# EAGLE design electrosteel2020_10_arrange6_synthboardsonly2 (EAGLE 9.6.2)
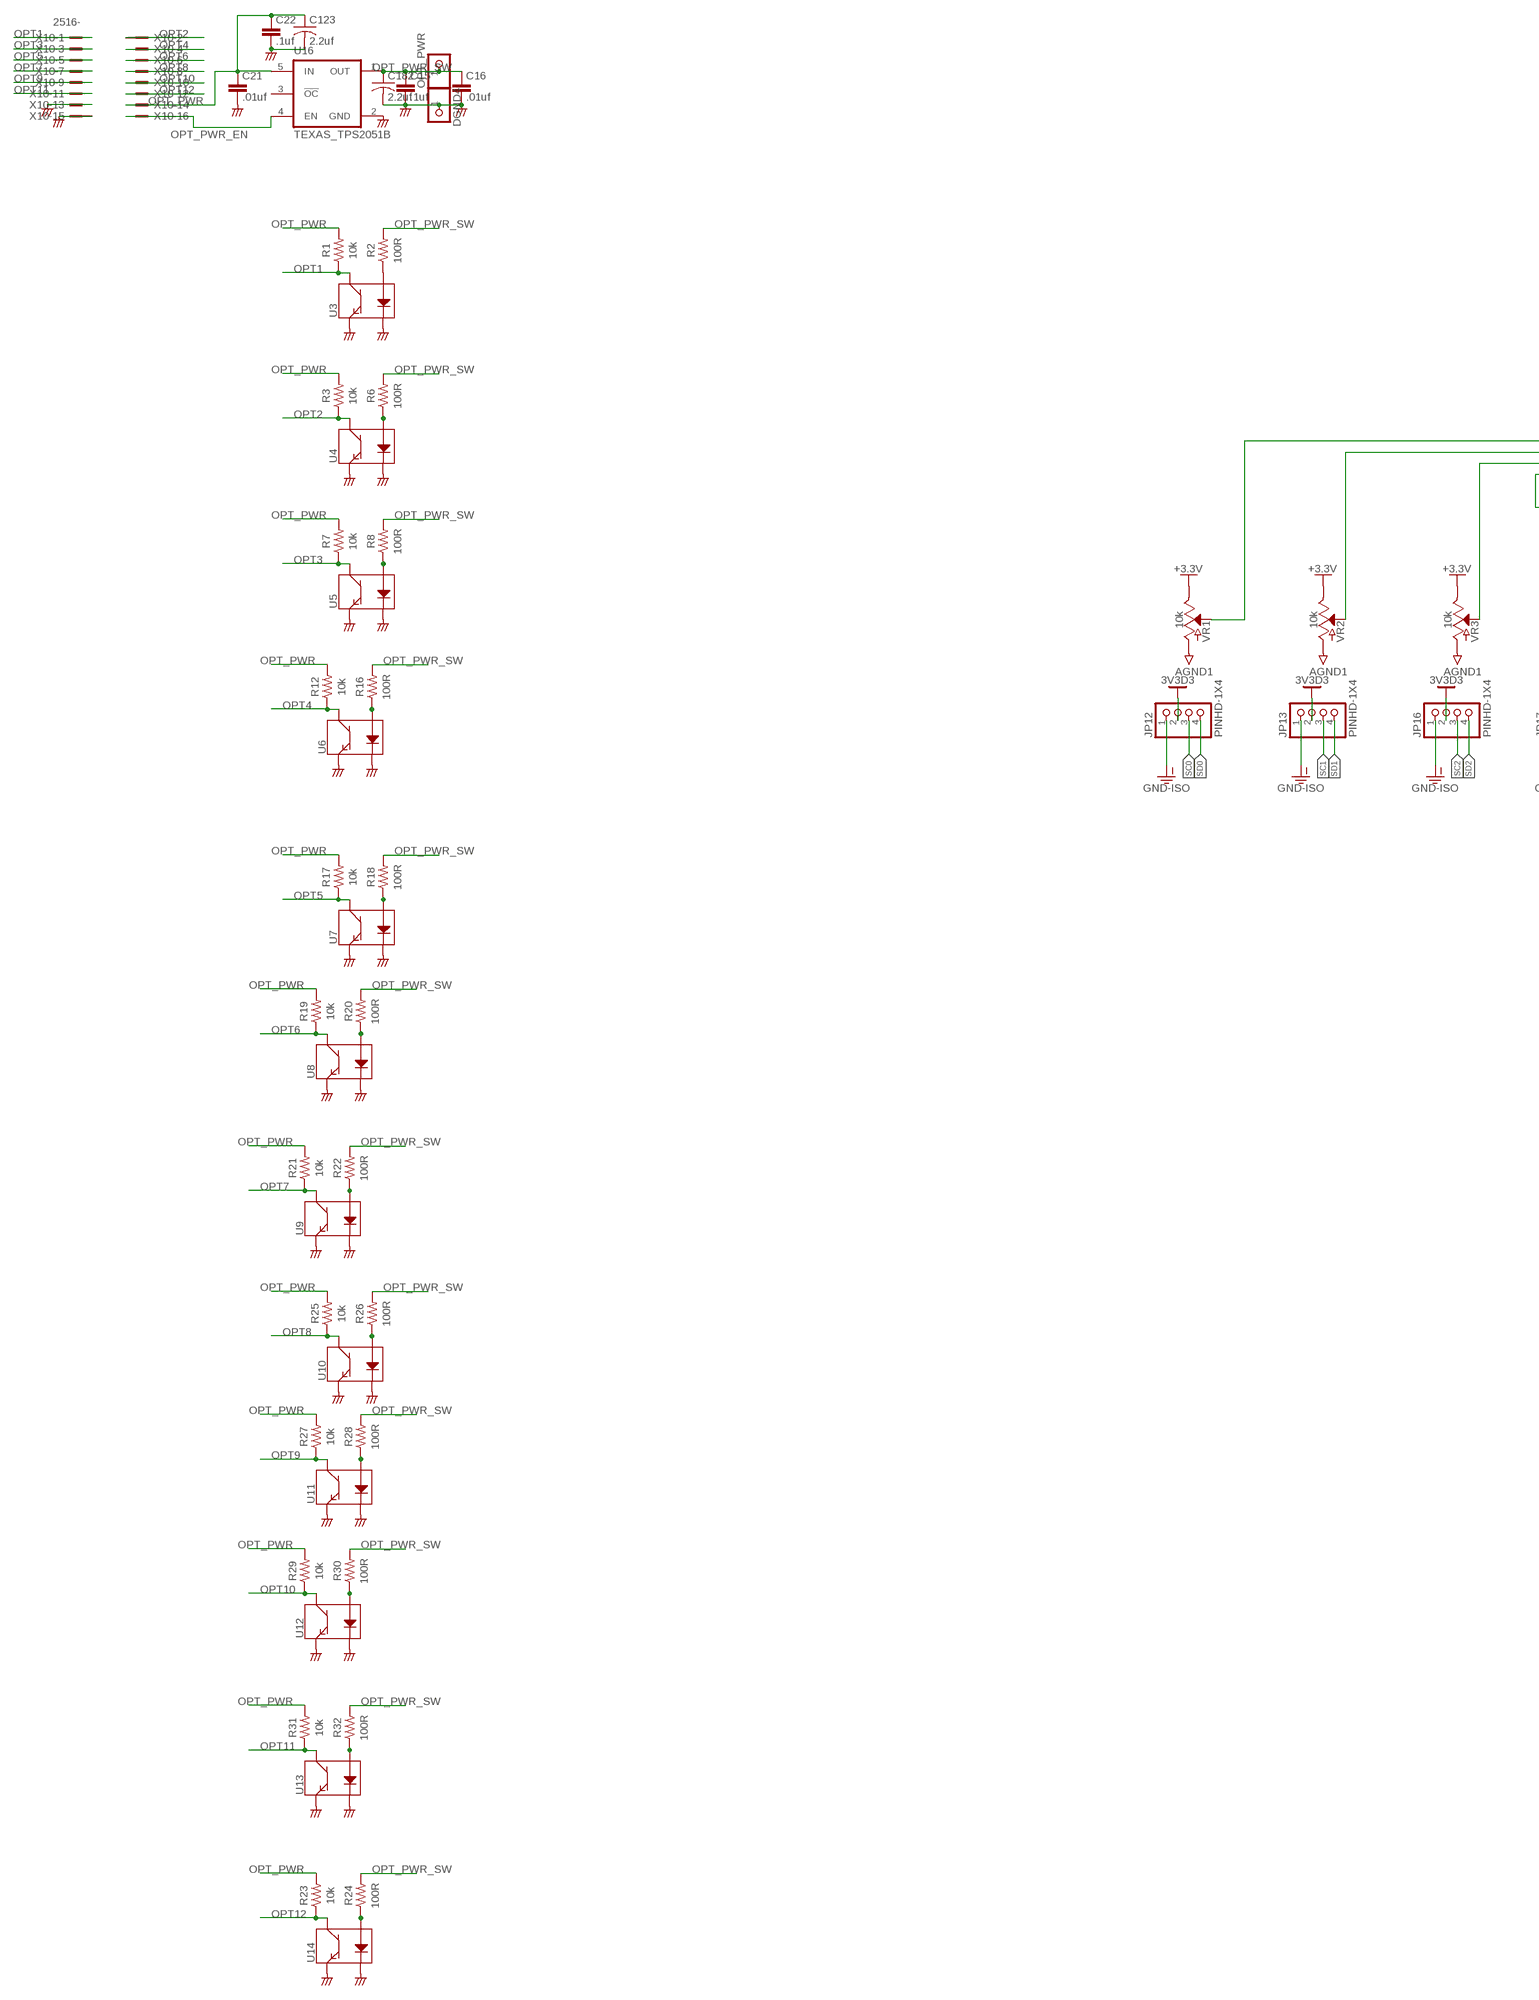
[diagram p0: schematic, sheet 1, part 1 of 3]
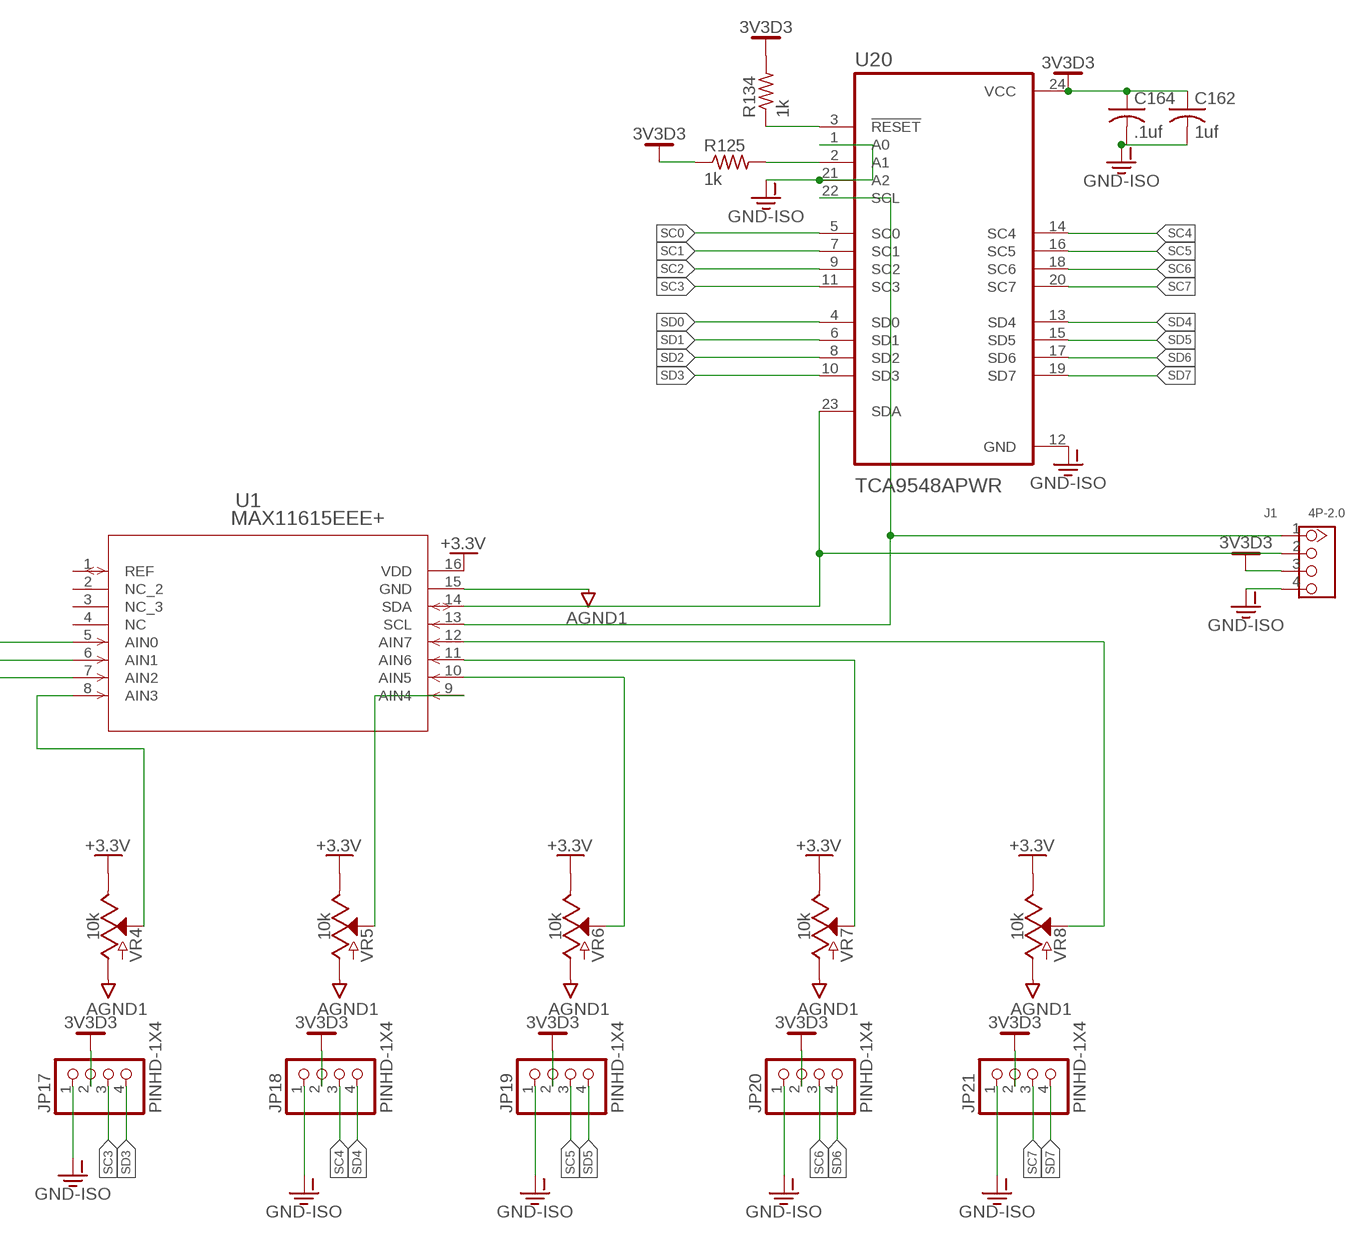
[diagram p1: schematic, sheet 1, part 2 of 3]
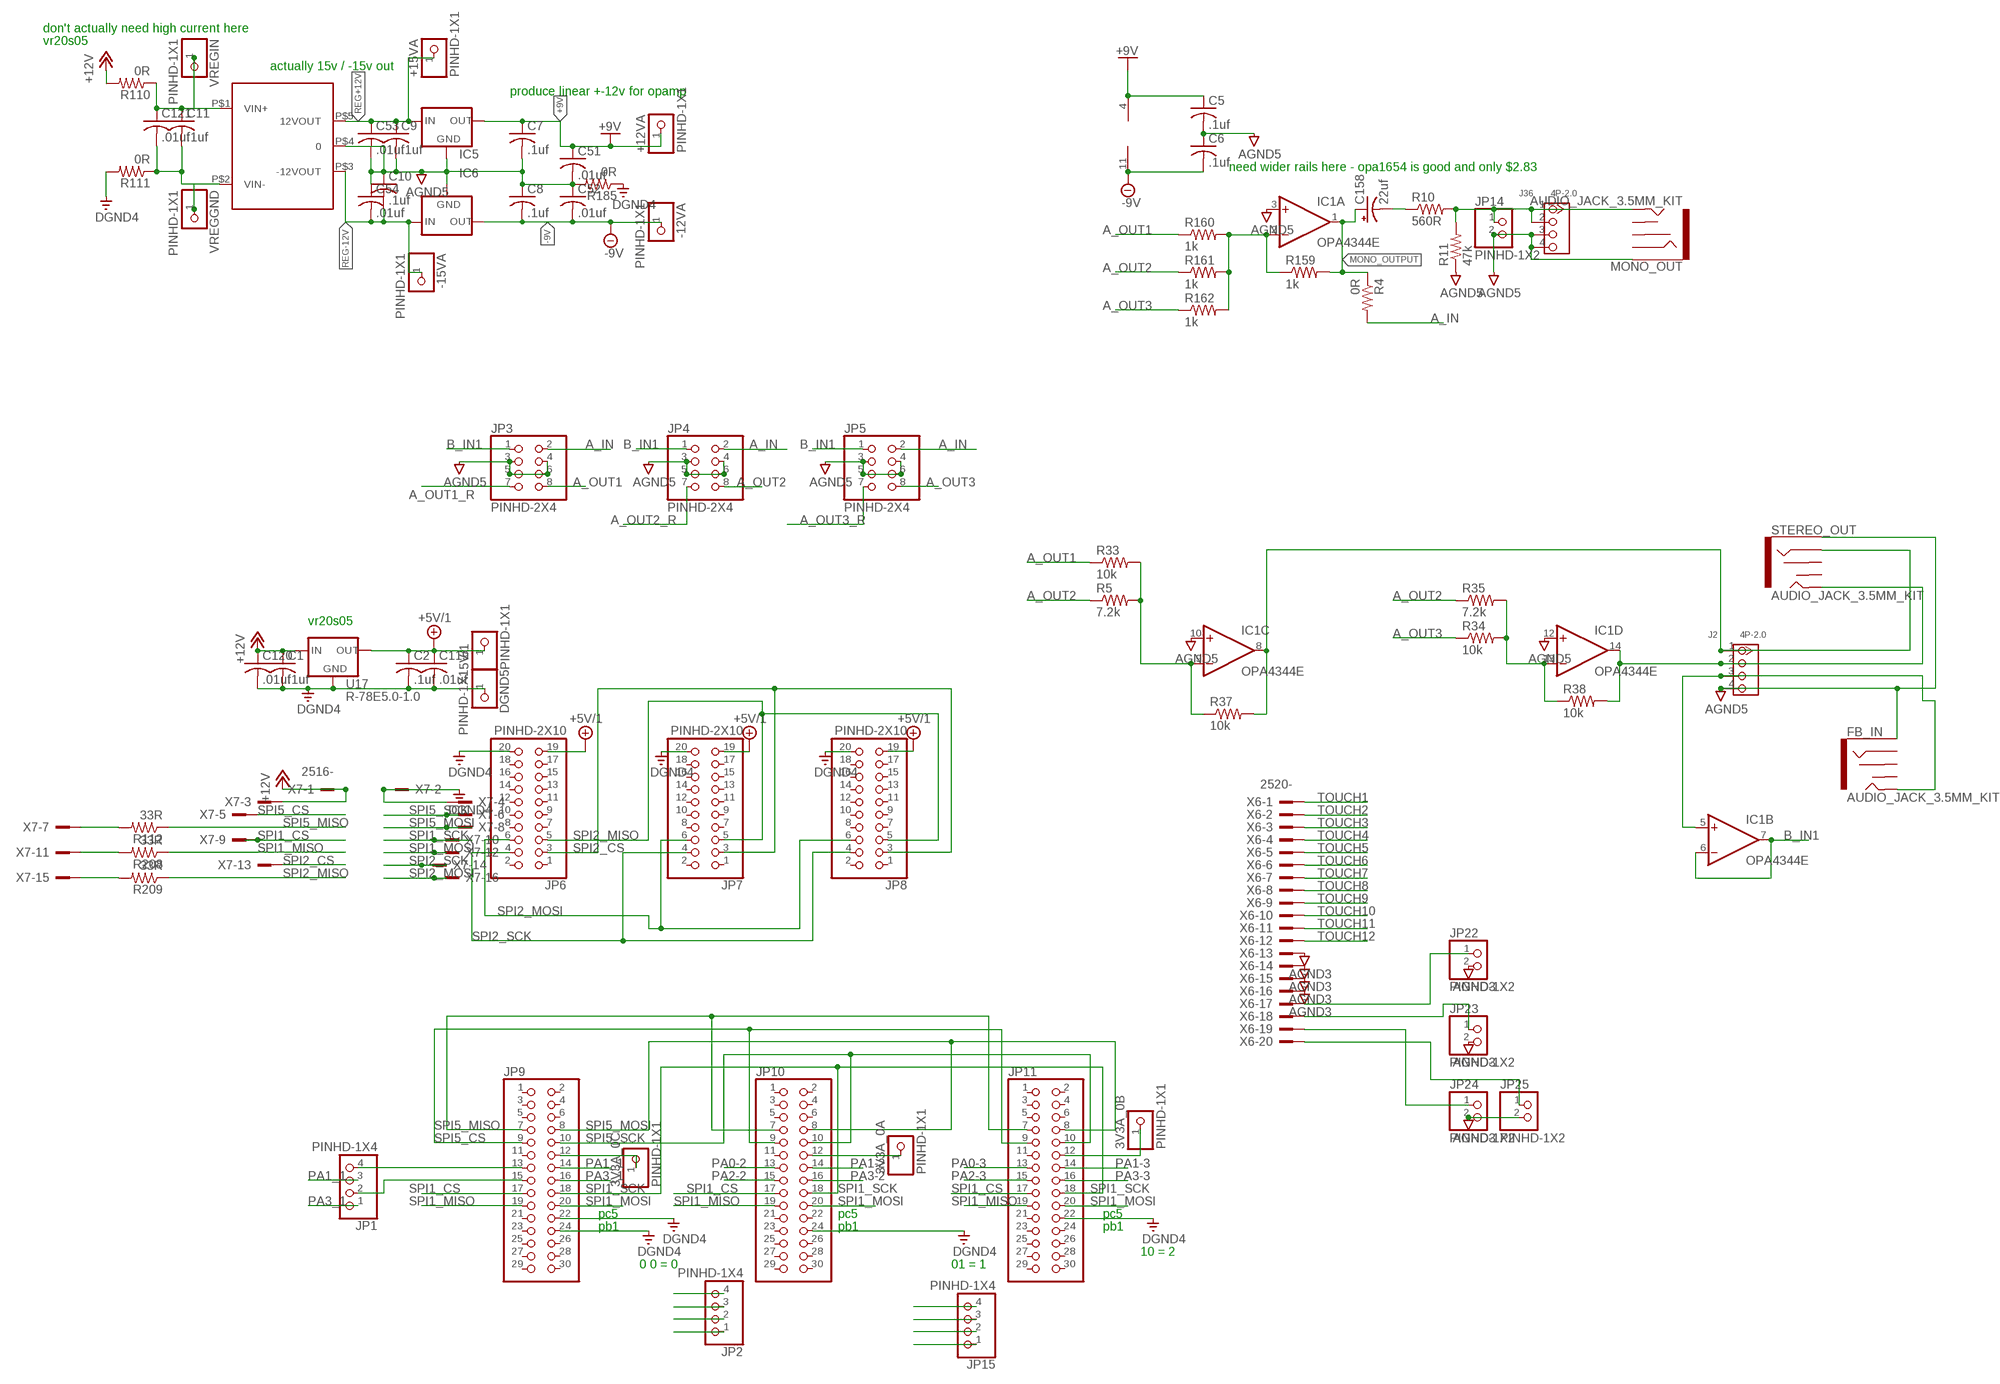
[diagram p2: schematic, sheet 1, part 3 of 3]

## Parts
3V3A_0A  PINHD-1X1  [1X01]
3V3A_0B  PINHD-1X1  [1X01]
3V3A_0C  PINHD-1X1  [1X01]
5V/1  PINHD-1X1  [1X01]
+12VA  PINHD-1X1  [1X01]
+15VA  PINHD-1X1  [1X01]
-12VA  PINHD-1X1  [1X01]
-15VA  PINHD-1X1  [1X01]
C1  .1uf  C-USC0603  [C0603]
C2  .1uf  C-USC0603  [C0603]
C5  .1uf  C-USC0603  [C0603]
C6  .1uf  C-USC0603  [C0603]
C7  .1uf  C-USC0603  [C0603]
C8  .1uf  C-USC0603  [C0603]
C9  .1uf  C-USC0603  [C0603]
C10  .1uf  C-USC0603  [C0603]
C11  .1uf  C-USC0603  [C0603]
C15  .1uf  CAP_0402  [0402]
C16  .01uf  CAP_0402  [0402]
C21  .01uf  CAP_0402  [0402]
C22  .1uf  CAP_0402  [0402]
C51  .01uf  C-USC0603  [C0603]
C52  .01uf  C-USC0603  [C0603]
C53  .01uf  C-USC0603  [C0603]
C54  .01uf  C-USC0603  [C0603]
C119  .01uf  C-USC0603  [C0603]
C120  .01uf  C-USC0603  [C0603]
C121  .01uf  C-USC0603  [C0603]
C123  2.2uf  C-USC1206  [C1206]
C158  22uf  CPOL-USD  [PANASONIC_D]
C162  1uf  C-USC1206K  [C1206K]
C164  .1uf  C-USC0603K  [C0603K]
C182  2.2uf  C-USC1206  [C1206]
DGND4  PINHD-1X1  [1X01]
DGND5  PINHD-1X1  [1X01]
FB_IN  AUDIO_JACK_3.5MM_KIT  [AUDIO-JACK-KIT]
IC1  OPA4344E  [TSSOP14]
IC5  78LXX  [78LXX]
IC6  79LXX  [79LXX]
J1  4P-2.0  GROVE-CONNECTOR-DIP(4P-2.0)  [HW4-2.0]
J2  4P-2.0  GROVE-CONNECTOR-DIP(4P-2.0)  [HW4-2.0]
J36  4P-2.0  GROVE-CONNECTOR-DIP(4P-2.0)  [HW4-2.0]
JP1  PINHD-1X4  [1X04]
JP2  PINHD-1X4  [1X04]
JP3  PINHD-2X4  [2X04]
JP4  PINHD-2X4  [2X04]
JP5  PINHD-2X4  [2X04]
JP6  PINHD-2X10  [2X10]
JP7  PINHD-2X10  [2X10]
JP8  PINHD-2X10  [2X10]
JP9  PINHD-2X15  [2X15]
JP10  PINHD-2X15  [2X15]
JP11  PINHD-2X15  [2X15]
JP12  PINHD-1X4  [1X04]
JP13  PINHD-1X4  [1X04]
JP14  PINHD-1X2  [1X02]
JP15  PINHD-1X4  [1X04]
JP16  PINHD-1X4  [1X04]
JP17  PINHD-1X4  [1X04]
JP18  PINHD-1X4  [1X04]
JP19  PINHD-1X4  [1X04]
JP20  PINHD-1X4  [1X04]
JP21  PINHD-1X4  [1X04]
JP22  PINHD-1X2  [1X02]
JP23  PINHD-1X2  [1X02]
JP24  PINHD-1X2  [1X02]
JP25  PINHD-1X2  [1X02]
MONO_OUT  AUDIO_JACK_3.5MM_KIT  [AUDIO-JACK-KIT]
OPT_PWR  PINHD-1X1  [1X01]
R1  10k  R-US_CHIP-0603(1608-METRIC)  [RESC1608X60]
R2  100R  R-US_CHIP-0603(1608-METRIC)  [RESC1608X60]
R3  10k  R-US_CHIP-0603(1608-METRIC)  [RESC1608X60]
R4  0R  R-US_R0603  [R0603]
R5  7.2k  R-US_R0603  [R0603]
R6  100R  R-US_CHIP-0603(1608-METRIC)  [RESC1608X60]
R7  10k  R-US_CHIP-0603(1608-METRIC)  [RESC1608X60]
R8  100R  R-US_CHIP-0603(1608-METRIC)  [RESC1608X60]
R10  560R  R-US_R0603  [R0603]
R11  47k  R-US_R0603  [R0603]
R12  10k  R-US_CHIP-0603(1608-METRIC)  [RESC1608X60]
R16  100R  R-US_CHIP-0603(1608-METRIC)  [RESC1608X60]
R17  10k  R-US_CHIP-0603(1608-METRIC)  [RESC1608X60]
R18  100R  R-US_CHIP-0603(1608-METRIC)  [RESC1608X60]
R19  10k  R-US_CHIP-0603(1608-METRIC)  [RESC1608X60]
R20  100R  R-US_CHIP-0603(1608-METRIC)  [RESC1608X60]
R21  10k  R-US_CHIP-0603(1608-METRIC)  [RESC1608X60]
R22  100R  R-US_CHIP-0603(1608-METRIC)  [RESC1608X60]
R23  10k  R-US_CHIP-0603(1608-METRIC)  [RESC1608X60]
R24  100R  R-US_CHIP-0603(1608-METRIC)  [RESC1608X60]
R25  10k  R-US_CHIP-0603(1608-METRIC)  [RESC1608X60]
R26  100R  R-US_CHIP-0603(1608-METRIC)  [RESC1608X60]
R27  10k  R-US_CHIP-0603(1608-METRIC)  [RESC1608X60]
R28  100R  R-US_CHIP-0603(1608-METRIC)  [RESC1608X60]
R29  10k  R-US_CHIP-0603(1608-METRIC)  [RESC1608X60]
R30  100R  R-US_CHIP-0603(1608-METRIC)  [RESC1608X60]
R31  10k  R-US_CHIP-0603(1608-METRIC)  [RESC1608X60]
R32  100R  R-US_CHIP-0603(1608-METRIC)  [RESC1608X60]
R33  10k  R-US_R0603  [R0603]
R34  10k  R-US_R0603  [R0603]
R35  7.2k  R-US_R0603  [R0603]
R37  10k  R-US_R0603  [R0603]
R38  10k  R-US_R0603  [R0603]
R110  0R  R-US_R0603  [R0603]
R111  0R  R-US_R0603  [R0603]
R112  33R  R-US_R0603  [R0603]
R125  1k  R-US_R0603  [R0603]
R134  1k  R-US_R0603  [R0603]
R159  1k  R-US_R0603  [R0603]
R160  1k  R-US_R0603  [R0603]
R161  1k  R-US_R0603  [R0603]
R162  1k  R-US_R0603  [R0603]
R185  0R  R-US_R0603  [R0603]
R208  33R  R-US_R0603  [R0603]
R209  33R  R-US_R0603  [R0603]
STEREO_OUT  AUDIO_JACK_3.5MM_KIT  [AUDIO-JACK-KIT]
U1  MAX11615EEE+  [21-0055H_16_MXM]
U3  QRE1113  [QRE1113]
U4  QRE1113  [QRE1113]
U5  QRE1113  [QRE1113]
U6  QRE1113  [QRE1113]
U7  QRE1113  [QRE1113]
U8  QRE1113  [QRE1113]
U9  QRE1113  [QRE1113]
U10  QRE1113  [QRE1113]
U11  QRE1113  [QRE1113]
U12  QRE1113  [QRE1113]
U13  QRE1113  [QRE1113]
U14  QRE1113  [QRE1113]
U16  TEXAS_TPS2051B  [TEXAS_SOT23-5]
U17  R-78E5.0-1.0  [DC-DC_CONVERTER_78XX]
U20  TCA9548APWR  [SOP65P640X120-24N]
U$3  CMR0512S3C  [CMR0512S3C]
VR1  10k  POTENTIOMETER-PTH-9MM-1/20W-20%  [POT-PTH-ALPS]
VR2  10k  POTENTIOMETER-PTH-9MM-1/20W-20%  [POT-PTH-ALPS]
VR3  10k  POTENTIOMETER-PTH-9MM-1/20W-20%  [POT-PTH-ALPS]
VR4  10k  POTENTIOMETER-PTH-9MM-1/20W-20%  [POT-PTH-ALPS]
VR5  10k  POTENTIOMETER-PTH-9MM-1/20W-20%  [POT-PTH-ALPS]
VR6  10k  POTENTIOMETER-PTH-9MM-1/20W-20%  [POT-PTH-ALPS]
VR7  10k  POTENTIOMETER-PTH-9MM-1/20W-20%  [POT-PTH-ALPS]
VR8  10k  POTENTIOMETER-PTH-9MM-1/20W-20%  [POT-PTH-ALPS]
VREGGND  PINHD-1X1  [1X01]
VREGIN  PINHD-1X1  [1X01]
X6  2520-  [PAK100/2500-20]
X7  2516-  [PAK100/2500-16]
X10  2516-  [PAK100/2500-16]

## Nets
3V3D3: C162.1 C164.1 J1.3 JP12.2 JP13.2 JP16.2 JP17.2 JP18.2 JP19.2 JP20.2 JP21.2 R125.1 R134.2 U20.24(VCC)
+3.3V: U1.16(VDD) VR1.P$1(E) VR2.P$1(E) VR3.P$1(E) VR4.P$1(E) VR5.P$1(E) VR6.P$1(E) VR7.P$1(E) VR8.P$1(E)
+5V/1: 5V/1.1 C2.1 C119.1 JP6.19 JP7.19 JP8.19 U17.VOUT(OUT)
+9V: +12VA.1 C5.1 C7.1 C51.1 IC1.4(P:V+) IC5.OUT
+12V: C1.1 C120.1 R110.2 U17.VIN(IN) X7.1 X7.3
-9V: -12VA.1 C6.2 C8.2 C52.2 IC1.11(P:V-) IC6.OUT
A_IN: JP3.2 JP4.2 JP5.2 R4.2
A_OUT1: JP3.8 R33.1 R160.1
A_OUT1_R: JP3.7
A_OUT2: JP4.8 R5.1 R35.1 R161.1
A_OUT2_R: JP4.7
A_OUT3: JP5.8 R34.1 R162.1
A_OUT3_R: JP5.7
AGND1: U1.15(GND) VR1.P$3(A) VR2.P$3(A) VR3.P$3(A) VR4.P$3(A) VR5.P$3(A) VR6.P$3(A) VR7.P$3(A) VR8.P$3(A)
AGND3: JP22.2 JP23.2 JP24.2 JP25.2 X6.13 X6.14 X6.15 X6.16
AGND5: C5.2 C6.1 C7.2 C8.1 C9.2 C10.1 C51.2 C52.1 C53.2 C54.1 FB_IN.SLEEVE IC1.3(A:+IN) IC1.10(C:+IN) IC1.12(D:+IN) IC5.GND IC6.GND J2.4 J36.3 J36.4 JP3.3 JP3.4 JP3.5 JP3.6 JP4.3 JP4.4 JP4.5 JP4.6 JP5.3 JP5.4 JP5.5 JP5.6 JP14.2 MONO_OUT.SLEEVE R11.1 R185.2 STEREO_OUT.SLEEVE U$3.P$4
B_IN1: IC1.6(B:-IN) IC1.7(B:OUT) JP3.1 JP4.1 JP5.1
CGND: C15.2 C16.2 C21.2 C22.2 C123.2 C182.2 DGND4.1 U3.2(K) U3.4(E) U4.2(K) U4.4(E) U5.2(K) U5.4(E) U6.2(K) U6.4(E) U7.2(K) U7.4(E) U8.2(K) U8.4(E) U9.2(K) U9.4(E) U10.2(K) U10.4(E) U11.2(K) U11.4(E) U12.2(K) U12.4(E) U13.2(K) U13.4(E) U14.2(K) U14.4(E) U16.2(GND) X10.13 X10.15 ; supply symbol labelled SUPPLY0_CGND_
DGND4: C1.2 C2.2 C119.2 C120.2 DGND5.1 JP6.20 JP7.20 JP8.20 JP9.22 JP9.24 JP10.24 JP11.22 R111.2 R185.1 U17.GND X7.2 X7.4
GND-ISO: C162.2 C164.2 J1.4 JP12.1 JP13.1 JP16.1 JP17.1 JP18.1 JP19.1 JP20.1 JP21.1 U20.1(A0) U20.12(GND) U20.21(A2)
MONO_OUTPUT: C158.+ IC1.1(A:OUT) R4.1 R159.2
N$1: R6.1 U4.1(A)
N$2: R2.1 U3.1(A)
N$3: U1.5(AIN0) VR1.P$2(S)
N$4: U1.6(AIN1) VR2.P$2(S)
N$5: U1.7(AIN2) VR3.P$2(S)
N$6: U1.8(AIN3) VR4.P$2(S)
N$7: R8.1 U5.1(A)
N$8: U1.9(AIN4) VR5.P$2(S)
N$9: U1.10(AIN5) VR6.P$2(S)
N$11: U1.11(AIN6) VR7.P$2(S)
N$12: U1.12(AIN7) VR8.P$2(S)
N$13: J1.2 U1.14(SDA) U20.23(SDA)
N$14: J1.1 U1.13(SCL) U20.22(SCL)
N$15: R125.2 U20.2(A1)
N$16: IC1.9(C:-IN) R5.2 R33.2 R37.1
N$17: IC1.13(D:-IN) R34.2 R35.2 R38.1
N$18: IC1.14(D:OUT) J2.2 R38.2 STEREO_OUT.TIP
N$19: IC1.8(C:OUT) J2.1 R37.2 STEREO_OUT.RING
N$20: JP24.1 X6.19
N$21: FB_IN.TIP IC1.5(B:+IN) J2.3
N$22: JP25.1 X6.20
N$23: JP23.1 X6.18
N$24: JP22.1 X6.17
N$27: IC1.2(A:-IN) R159.1 R160.2 R161.2 R162.2
N$33: R16.1 U6.1(A)
N$35: R18.1 U7.1(A)
N$36: R20.1 U8.1(A)
N$37: R22.1 U9.1(A)
N$38: R24.1 U14.1(A)
N$39: R26.1 U10.1(A)
N$40: R28.1 U11.1(A)
N$41: R30.1 U12.1(A)
N$42: R32.1 U13.1(A)
N$105: C11.2 C121.2 R111.1 U$3.P$2(VIN-) VREGGND.1
N$106: C11.1 C121.1 R110.1 U$3.P$1(VIN+) VREGIN.1
N$174: R134.1 U20.3(!RESET)
N$249: C158.- R10.1
N$265: J36.1 J36.2 JP14.1 MONO_OUT.TIP R10.2 R11.2
N$284: R209.2 X7.15
N$293: R208.2 X7.11
N$294: R112.2 X7.7
N$298: JP1.4 JP9.13
N$299: 3V3A_0C.1 JP9.12
N$300: JP1.2 JP9.15
N$309: 3V3A_0A.1 JP10.12
N$310: 3V3A_0B.1 JP11.12
OPT1: R1.1 U3.3(C) X10.1
OPT2: R3.1 U4.3(C) X10.2
OPT3: R7.1 U5.3(C) X10.3
OPT4: R12.1 U6.3(C) X10.4
OPT5: R17.1 U7.3(C) X10.5
OPT6: R19.1 U8.3(C) X10.6
OPT7: R21.1 U9.3(C) X10.7
OPT8: R25.1 U10.3(C) X10.8
OPT9: R27.1 U11.3(C) X10.9
OPT10: R29.1 U12.3(C) X10.10
OPT11: R31.1 U13.3(C) X10.11
OPT12: R23.1 U14.3(C) X10.12
OPT_PWR: C21.1 C22.1 C123.1 R1.2 R3.2 R7.2 R12.2 R17.2 R19.2 R21.2 R23.2 R25.2 R27.2 R29.2 R31.2 U16.5(IN) X10.14
OPT_PWR_EN: U16.4(EN) X10.16
OPT_PWR_SW: C15.1 C16.1 C182.1 OPT_PWR.1 R2.2 R6.2 R8.2 R16.2 R18.2 R20.2 R22.2 R24.2 R26.2 R28.2 R30.2 R32.2 U16.1(OUT)
PA0-2: JP2.4 JP10.13
PA0-3: JP11.13 JP15.4
PA1-2: JP2.3 JP10.14
PA1-3: JP11.14 JP15.3
PA1_1: JP1.3 JP9.14
PA2-2: JP2.2 JP10.15
PA2-3: JP11.15 JP15.2
PA3-2: JP2.1 JP10.16
PA3-3: JP11.16 JP15.1
PA3_1: JP1.1 JP9.16
REG+12V: +15VA.1 C9.1 C53.1 IC5.IN U$3.P$5(12VOUT)
REG-12V: -15VA.1 C10.2 C54.2 IC6.IN U$3.P$3(-12VOUT)
SC0: JP12.3 U20.5(SC0)
SC1: JP13.3 U20.7(SC1)
SC2: JP16.3 U20.9(SC2)
SC3: JP17.3 U20.11(SC3)
SC4: JP18.3 U20.14(SC4)
SC5: JP19.3 U20.16(SC5)
SC6: JP20.3 U20.18(SC6)
SC7: JP21.3 U20.20(SC7)
SD0: JP12.4 U20.4(SD0)
SD1: JP13.4 U20.6(SD1)
SD2: JP16.4 U20.8(SD2)
SD3: JP17.4 U20.10(SD3)
SD4: JP18.4 U20.13(SD4)
SD5: JP19.4 U20.15(SD5)
SD6: JP20.4 U20.17(SD6)
SD7: JP21.4 U20.19(SD7)
SPI1_CS: JP9.17 JP10.17 JP11.17 X7.9
SPI1_MISO: JP9.19 JP10.19 JP11.19 R208.1
SPI1_MOSI: JP9.20 JP10.20 JP11.20 X7.12
SPI1_SCK: JP9.18 JP10.18 JP11.18 X7.10
SPI2_CS: JP6.3 JP7.3 JP8.3 X7.13
SPI2_MISO: JP6.5 JP7.5 JP8.5 R209.1
SPI2_MOSI: JP6.6 JP7.6 JP8.6 X7.16
SPI2_SCK: JP6.4 JP7.4 JP8.4 X7.14
SPI5_CS: JP9.9 JP10.9 JP11.9 X7.5
SPI5_MISO: JP9.7 JP10.7 JP11.7 R112.1
SPI5_MOSI: JP9.8 JP10.8 JP11.8 X7.8
SPI5_SCK: JP9.10 JP10.10 JP11.10 X7.6
TOUCH1: X6.1
TOUCH2: X6.2
TOUCH3: X6.3
TOUCH4: X6.4
TOUCH5: X6.5
TOUCH6: X6.6
TOUCH7: X6.7
TOUCH8: X6.8
TOUCH9: X6.9
TOUCH10: X6.10
TOUCH11: X6.11
TOUCH12: X6.12
Unconnected: FB_IN.RING FB_IN.RSH FB_IN.TSH JP6.1 JP6.2 JP6.7 JP6.8 JP6.9 JP6.10 JP6.11 JP6.12 JP6.13 JP6.14 JP6.15 JP6.16 JP6.17 JP6.18 JP7.1 JP7.2 JP7.7 JP7.8 JP7.9 JP7.10 JP7.11 JP7.12 JP7.13 JP7.14 JP7.15 JP7.16 JP7.17 JP7.18 JP8.1 JP8.2 JP8.7 JP8.8 JP8.9 JP8.10 JP8.11 JP8.12 JP8.13 JP8.14 JP8.15 JP8.16 JP8.17 JP8.18 JP9.1 JP9.2 JP9.3 JP9.4 JP9.5 JP9.6 JP9.11 JP9.21 JP9.23 JP9.25 JP9.26 JP9.27 JP9.28 JP9.29 JP9.30 JP10.1 JP10.2 JP10.3 JP10.4 JP10.5 JP10.6 JP10.11 JP10.21 JP10.22 JP10.23 JP10.25 JP10.26 JP10.27 JP10.28 JP10.29 JP10.30 JP11.1 JP11.2 JP11.3 JP11.4 JP11.5 JP11.6 JP11.11 JP11.21 JP11.23 JP11.24 JP11.25 JP11.26 JP11.27 JP11.28 JP11.29 JP11.30 MONO_OUT.RING MONO_OUT.RSH MONO_OUT.TSH STEREO_OUT.RSH STEREO_OUT.TSH U1.1(REF) U1.2(NC_2) U1.3(NC_3) U1.4(NC) U16.3(!OC!)

## Notes on the sheet
- don't actually need high current here
- vr20s05
- actually 15v / -15v out
- produce linear +-12v for opamp
- need wider rails here - opa1654 is good and only $2.83
- vr20s05
- pc5 | pc5 | pc5
- pb1 | pb1 | pb1
- 10 = 2
- 0 0 = 0 | 01 = 1

## Library data of the parts
3V3A_0A 3V3A_0B 3V3A_0C 5V/1 +12VA +15VA -12VA -15VA DGND5 VREGGND VREGIN = Connector:PINHD-1X1: PIN HEADER; CATEGORY: CONNECTOR; PARTNO: *DNP; SUB-CATEGORY: PIN-HEADER
C1 C2 C5-C11 C51-C54 C119-C121 = rcl:C-US: CAPACITOR, American symbol; PARTNO: TMK063B7103KP-F; SPICEPREFIX: C
C15 C22 = Perfect_0402:CAP_0402: 0402 (1005 Metric) Nick Garner - TeleSense; PARTNO: CC0402KRX7R8BB104
C16 C21 = Perfect_0402:CAP_0402: 0402 (1005 Metric) Nick Garner - TeleSense; PARTNO: CC0402KRX7R8BB103
C123 C182 = adafruit:C-US: CAPACITOR, American symbol; PARTNO: T491A225K020AT
C158 = adafruit:CPOL-US: POLARIZED CAPACITOR, American symbol; PARTNO: EEE-1CA220NP
C162 = adafruit:C-US: CAPACITOR, American symbol; PARTNO: C3216X7R1E105K085AA
C164 = adafruit:C-US: CAPACITOR, American symbol; PARTNO: CC0603KRX7R8BB104
DGND4 OPT_PWR = adafruit:PINHD-1X1: Pin header 1x1 for 0.1" spacing With round pins; PARTNO: *DNP
FB_IN MONO_OUT STEREO_OUT = SparkFun-Connectors:AUDIO_JACK_3.5MM: Audio Jack 3.5mm variants of PTH and SMT stereo audio jack with bypass switches. SparkFun Products: SparkFun SparkPunk Sound Kit <[https://www.sparkfun.com/products/11177]> - PTH MP3 Trigger <https://www.sparkfun.com/products/13720> -3.5mm SMD SparkFun PicoBoard <https://www.sparkfun.com/products/11888>- 2.5mm SMD; PROD_ID: CONN-08774; SF_ID: PRT-08032
IC1 = linear:OPA4*: Quad Operational Amplifier compatible with: TLC27L4 Low Power, Single-Supply, Rail-To-Rail Operational Amplifier Source: http://focus.ti.com/lit/ds/symlink/opa2345.pdf http://focus.ti.com .. opa241.pdf http://focus.ti.com .. tlc27l4.pdf http://focus.ti.com/lit/ds/symlink/opa2134.pdf; PARTNO: OPA1654AIPWR
IC5 = v-reg:78LXX: VOLTAGE REGULATOR; PARTNO: LM78L12ACZ/LFT7
IC6 = v-reg:79LXX: VOLTAGE REGULATOR; PARTNO: L79L12ACZ-TR
J1 J2 J36 = OPL_Connector:GROVE-CONNECTOR-DIP(4P-2.0): 320110033; PARTNO: 110990030
JP1 JP2 JP12 JP13 JP15-JP21 = Connector:PINHD-1X4: PIN HEADER; CATEGORY: CONNECTOR; SUB-CATEGORY: PIN-HEADER
JP3-JP5 = Connector:PINHD-2X4: PIN HEADER; CATEGORY: CONNECTOR; PARTNO: 77313-101-08LF; SUB-CATEGORY: PIN-HEADER
JP6-JP8 = Connector:PINHD-2X10: PIN HEADER; CATEGORY: CONNECTOR; PARTNO: 77313-101-20LF; SUB-CATEGORY: PIN-HEADER
JP9-JP11 = pinhead:PINHD-2X15: PIN HEADER; PARTNO: 77313-101-30LF
JP14 JP22-JP25 = Connector:PINHD-1X2: PIN HEADER; CATEGORY: CONNECTOR; PARTNO: *DNP; SUB-CATEGORY: PIN-HEADER
R1 R3 R7 R12 R17 R19 R21 R23 R25 R27 R29 R31 = Resistor:R-US: Resistor Fixed - ANSI; CATEGORY: Resistor; PARTNO: ESR03EZPF1002; SUB-CATEGORY: Fixed
R2 R6 R8 R16 R18 R20 R22 R24 R26 R28 R30 R32 = Resistor:R-US: Resistor Fixed - ANSI; CATEGORY: Resistor; PARTNO: ESR03EZPJ101; SUB-CATEGORY: Fixed
R4 R110 R111 R185 = Resistor:R-US_: RESISTOR, American symbol; PARTNO: RCS06030000Z0EA
R5 R33-R35 R37 R38 R125 R134 R159-R162 = Resistor:R-US_: RESISTOR, American symbol; PARTNO: ESR03EZPF1001
R10 = Resistor:R-US_: RESISTOR, American symbol; PARTNO: ESR03EZPF5600
R11 = Resistor:R-US_: RESISTOR, American symbol; PARTNO: ESR03EZPJ473
R112 R208 R209 = rcl:R-US_: RESISTOR, American symbol; PARTNO: RC0201FR-0733RL; SPICEPREFIX: R
U1 = custom:MAX11615EEE+; BUILT_BY: EMA_UL_Team; MANUFACTURER_PART_NUMBER: max11615eee+; SOURCELIBRARY: Maxim_2009-12-17_3a; VENDOR: Maxim Integrated Products
U3-U14 = SparkFun-Sensors:QRE1113: QRE1113 Reflective Object Sensor The QRE1113 is a small IR reflectance sensor. This sensor is often used in line following robots because, if it can sense if a surface is white or black. There are four pins on the QRE1113 - two control the IR emitting LED while the other two are the collector and emitter of a phototransistor. The IR diode has a max forward current of 50mA and operates at 940nm. Datasheet <http://www.sparkfun.com/datasheets/Components/SMD/QRE1113.GR.pdf> SparkFun Products IR Reflectance Sensor - QRE1113 <https://www.sparkfun.com/products/9542> (COM-09542) SparkFun Line Sensor Breakout - QRE1113 (Analog) <https://www.sparkfun.com/products/9453> (ROB-09453) SparkFun Line Sensor Breakout - QRE1113 (Digital) <https://www.sparkfun.com/products/9454> (ROB-09454) SparkFun RedBot Sensor - Line Follower <https://www.sparkfun.com/products/11769> (SEN-11769) SparkFun RedBot Sensor - Wheel Encoder <https://www.sparkfun.com/products/12617> (SEN-12617) SparkFun Line Follower Array <https://www.sparkfun.com/products/13582> (SEN-13582); PARTNO: QRE1113GR; PROD_ID: IC-09357; SF_ID: COM-09542
U16 = LinkedLibrary52101:TEXAS_TPS2051B: POWER-DISTRIBUTION SWITCH; PARTNO: TPS2051BDBVRG4
U17 = SparkFun-IC-Power:R-78E5.0-1.0: Recom Power 5V 1A DC/DC Converter The Recom R-78E5.0-X.X is a compact DC/DC converter module that is a pin for pin drop-in replacement for the LM7805 linear voltage regulator. Specifications: Input Range: 7-28V Output Voltage: 5V Output Current: 1A Max Efficiency: 91% Datasheet <https://www.recom-power.com/pdf/Innoline/R-78Exx-1.0.pdf>; PARTNO: R-78E5.0-1.0; PROD_ID: COM-13655
U20 = TCA9548APWR:TCA9548APWR: Check prices <https://pricing.snapeda.com/parts/TCA9548APWR/Texas%20Instruments/view-part?ref=eda>; AVAILABILITY: Good; DESCRIPTION: Low-Voltage 8-Channel I2C Switch With Reset 24-TSSOP -40 to 85; MF: Texas Instruments; MP: TCA9548APWR; PACKAGE: TSSOP-24 Texas Instruments; PARTNO: TCA9548APWR; PRICE: None; PURCHASE-URL: https://pricing.snapeda.com/search/part/TCA9548APWR/?ref=eda
U$3 = custom:CMR0512S3C; PARTNO: DPU01M-15
VR1-VR8 = SparkFun-Resistors:POTENTIOMETER: Potentiometer (Pot) Three-terminal potentiometers, with an adjustable wiper and two adjustable resistors. A pot can be used to create a configurable voltage divider, or as a variable resistor. Variants ALPS_POT and ALPS_POT_KIT - PTH, breadboard compatible, 9mm square pots Rotary Potentiometer - Linear (10k ohm) <https://www.sparkfun.com/products/9288> (COM-09288) The KIT variant exposes copper on only one side of the PTH pad, so the part can only be assembled on one side of the PCB. Useful for beginner soldering kits.; PROD_ID: RES-09177; SF_SKU: COM-09288
X6 = con-3m:2520-: 3M (TM) Pak 100 4-Wall Header Source: 3M; OC_FARNELL: unknown; OC_NEWARK: unknown; PARTNO: N2520-6003-UG
X7 X10 = con-3m:2516-: 3M (TM) Pak 100 4-Wall Header Source: 3M; OC_FARNELL: unknown; OC_NEWARK: unknown; PARTNO: D2516-6002-AR

## Board
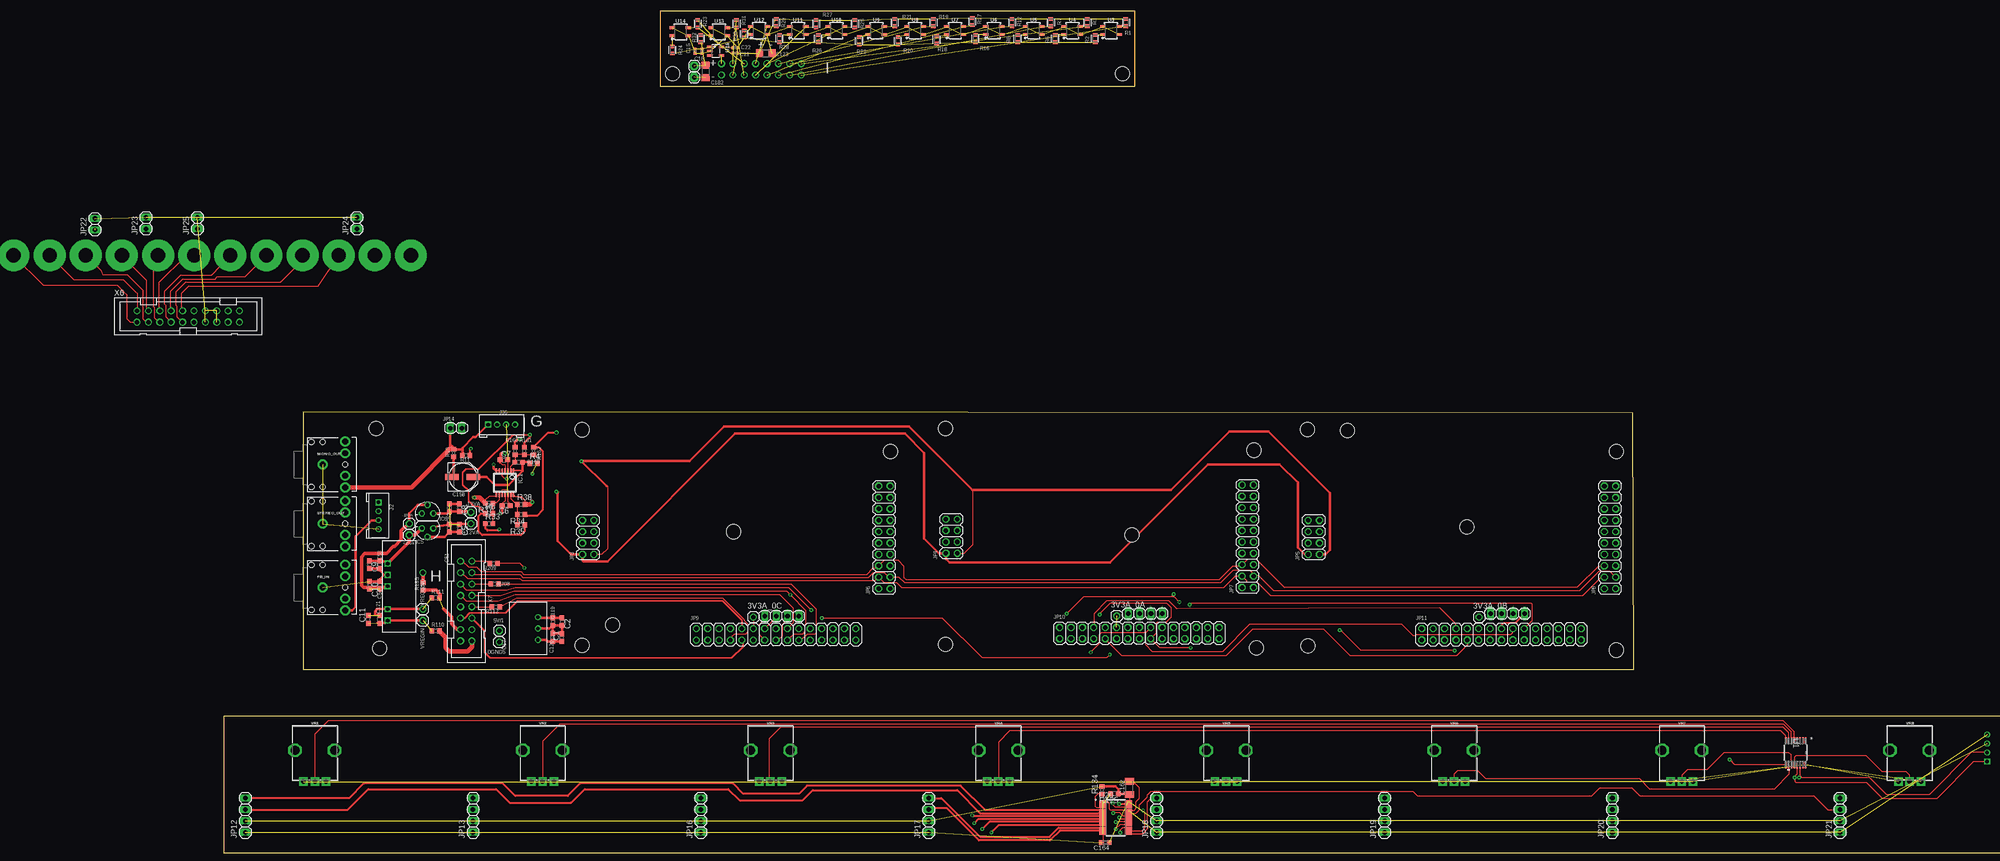
[diagram p3: board, top side]
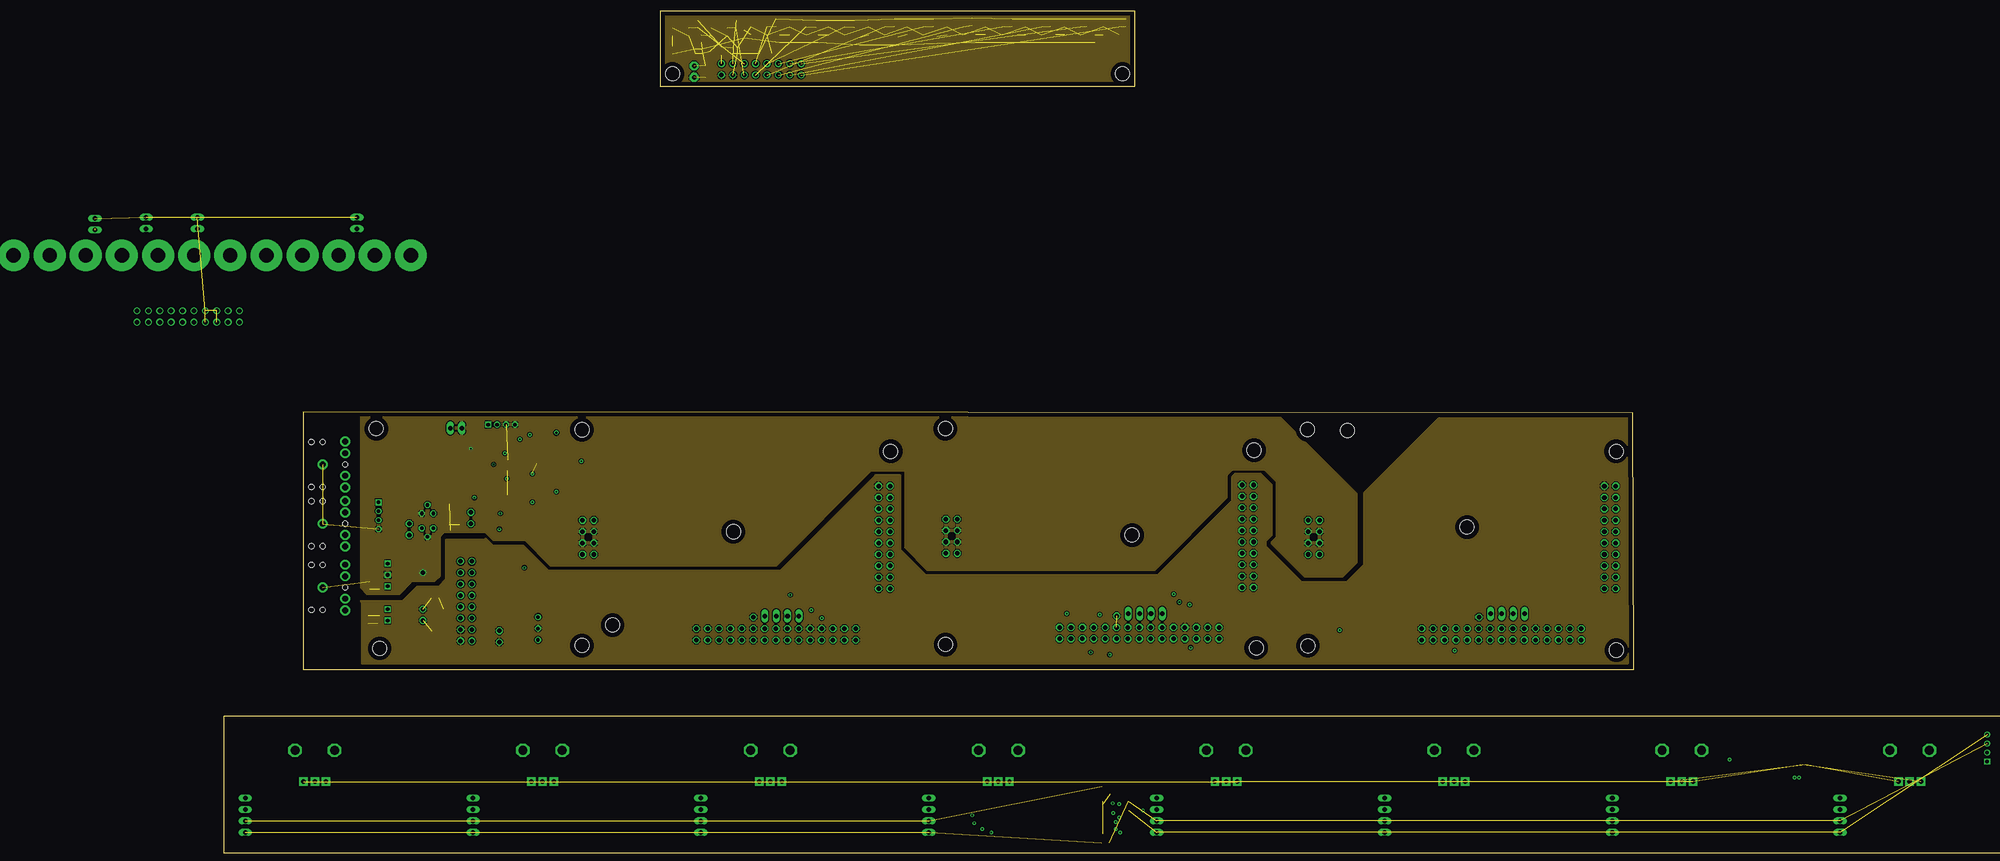
[diagram p4: board, inner layer Route2]
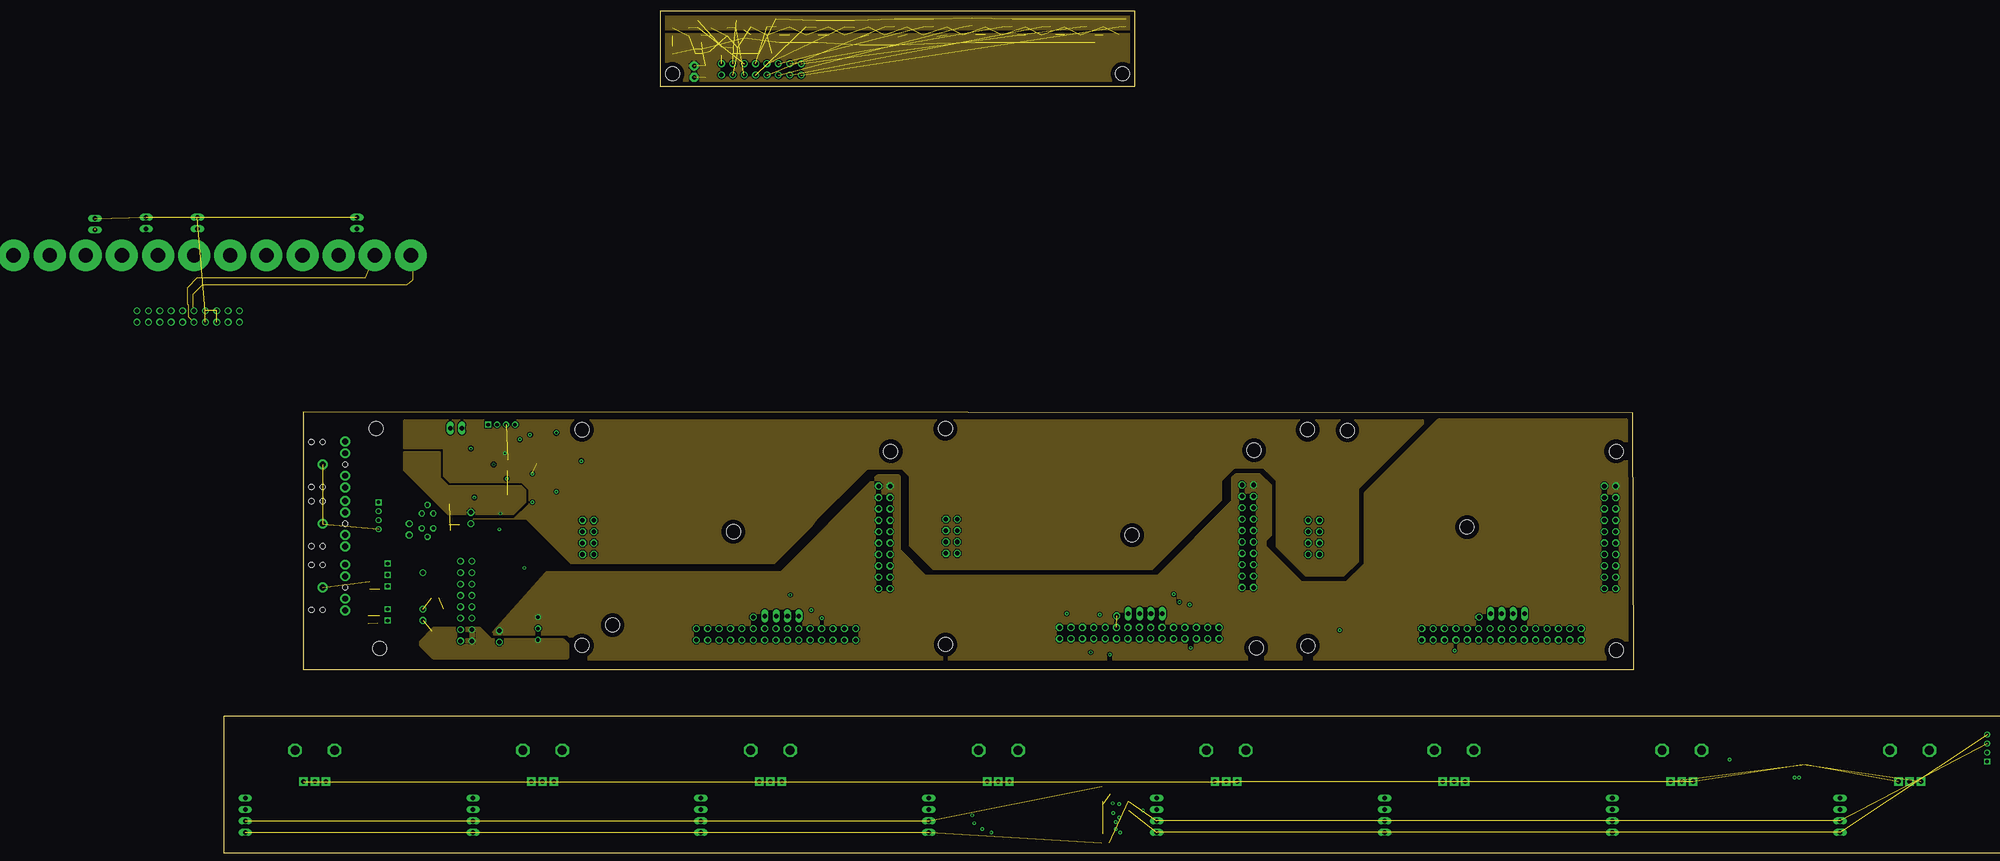
[diagram p5: board, inner layer Route15]
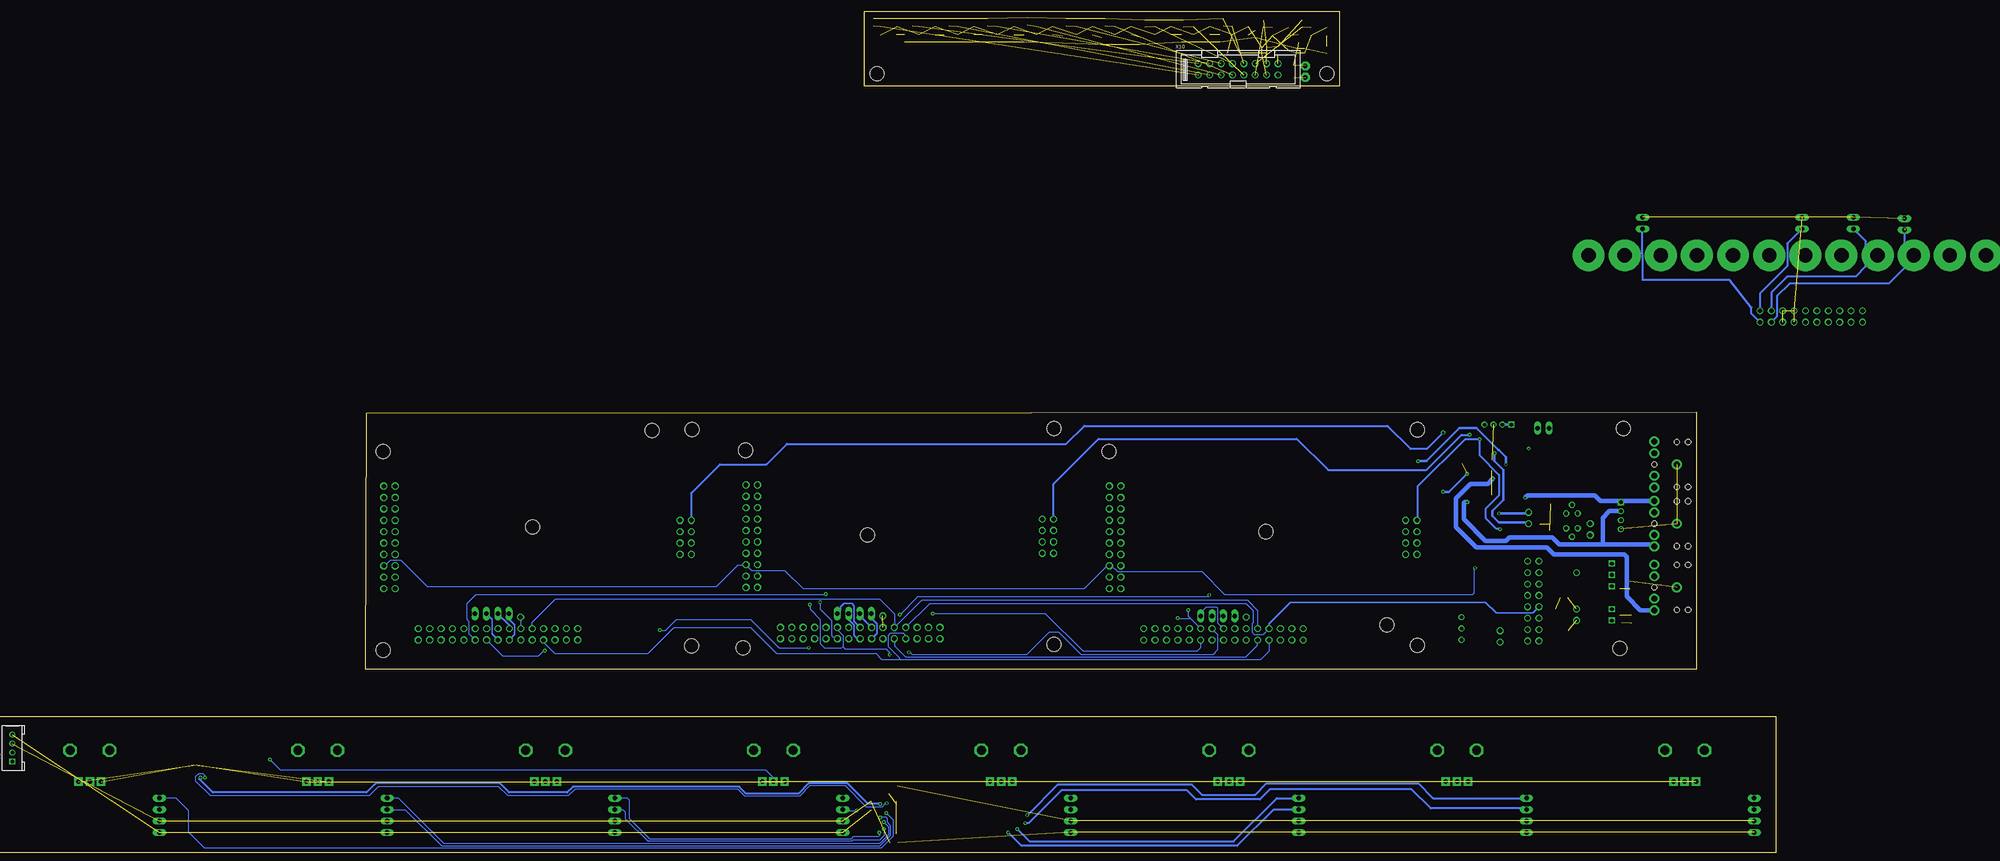
[diagram p6: board, bottom side, seen from below]

Size 296.67 x 146.81 mm. Coordinates in mm from the lower left corner, seen from the top.
Outline: 0,57.4 0,0 296.67,0 296.42,57.15 0,57.4
Outline: 185.42,130.05 185.42,146.81 79.5,146.81 79.5,130.05 185.42,130.05
Copper layers (1+2*15+16): Top 0.035mm / dielectric 0.5mm / Route2 0.035mm / dielectric 0.5mm / Route15 0.035mm / dielectric 0.5mm / Bottom 0.035mm
Design rules "default *": minimum track width 6mil, minimum drill 0.35mm, track to track 9mil, track to pad 9mil, pad to pad 9mil, via to via 9mil, smd to smd 9mil, copper to edge 40mil, drill to drill 6mil, minimum pad ring 10mil, minimum via ring 8mil, stop-mask expansion 4mil, vias tented up to drill 0mil, thermal gap 10mil
Holes 3.17 mm at 62.1,53.47 130.94,48.64 62.1,5.33 143.13,53.72 211.96,48.9 143.18,5.56 223.9,53.49 292.71,48.67 223.98,5.31 95.88,30.73 184.78,29.97 259.46,31.75 16.26,53.72 292.74,4.32 232.79,53.34 68.96,9.91 212.47,4.83 182.63,132.84 82.3,132.84 17.02,4.7
Milling: 8 lines

### Footprints (pad centres in the part's own frame; a part is rotated, then mirrored left to right if it is on the bottom)
1X01 = drill 1.016 octagon: 1 0,0
C0603 = smd 1.1 x 1: 1 -0.85,0; 2 0.85,0
0402 = smd 0.6 x 0.7: 1 -0.5,0; 2 0.5,0
C1206 = smd 1.6 x 1.8: 1 -1.4,0; 2 1.4,0
PANASONIC_D = smd 3 x 1.4: + 2.4,0; - -2.4,0
C1206K = smd 1.5 x 2: 1 -1.5,0; 2 1.5,0
C0603K = smd 1.05 x 1.08: 1 -0.875,0; 2 0.875,0
1X01' = drill 1.016 pad 1.93 octagon: 1 0,0
AUDIO-JACK-KIT = drill 1.3 pad 2.184: RING 5,5.1; RSH 5,2.5; SLEEVE 0,0; TIP 5,-5.1; TSH 5,-2.5 | hole 1.2: 0,5; -2.5,5; -2.5,-5; 0,-5; 5,0
TSSOP14 = smd 0.305 x 0.991: 1 -1.905,-2.718; 2 -1.27,-2.718; 3 -0.635,-2.718; 4 0,-2.718; 5 0.635,-2.718; 6 1.27,-2.718; 7 1.905,-2.718; 8 1.905,2.718; 9 1.27,2.718; 10 0.635,2.718; 11 0,2.718; 12 -0.635,2.718; 13 -1.27,2.718; 14 -1.905,2.718
78LXX = drill 0.813 octagon: GND 0,1.905; IN 1.27,0; OUT -1.27,0
79LXX = drill 0.813 octagon: GND -1.27,0; IN 0,1.905; OUT 1.27,0
HW4-2.0 = drill 0.8 pad 1.27 square: 1 -3,0 | drill 0.8 pad 1.27: 2 -1,0; 3 1,0; 4 3,0
1X04 = drill 1.016 long: 1 -3.81,0; 2 -1.27,0; 3 1.27,0; 4 3.81,0
2X04 = drill 1.016 octagon: 1 -3.81,-1.27; 2 -3.81,1.27; 3 -1.27,-1.27; 4 -1.27,1.27; 5 1.27,-1.27; 6 1.27,1.27; 7 3.81,-1.27; 8 3.81,1.27
2X10 = drill 1.016 octagon: 1 -11.43,-1.27; 2 -11.43,1.27; 3 -8.89,-1.27; 4 -8.89,1.27; 5 -6.35,-1.27; 6 -6.35,1.27; 7 -3.81,-1.27; 8 -3.81,1.27; 9 -1.27,-1.27; 10 -1.27,1.27; 11 1.27,-1.27; 12 1.27,1.27; 13 3.81,-1.27; 14 3.81,1.27; 15 6.35,-1.27; 16 6.35,1.27; 17 8.89,-1.27; 18 8.89,1.27; 19 11.43,-1.27; 20 11.43,1.27
2X15 = drill 1.016 octagon: 1 -17.78,-1.27; 2 -17.78,1.27; 3 -15.24,-1.27; 4 -15.24,1.27; 5 -12.7,-1.27; 6 -12.7,1.27; 7 -10.16,-1.27; 8 -10.16,1.27; 9 -7.62,-1.27; 10 -7.62,1.27; 11 -5.08,-1.27; 12 -5.08,1.27; 13 -2.54,-1.27; 14 -2.54,1.27; 15 0,-1.27; 16 0,1.27; 17 2.54,-1.27; 18 2.54,1.27; 19 5.08,-1.27; 20 5.08,1.27; 21 7.62,-1.27; 22 7.62,1.27; 23 10.16,-1.27; 24 10.16,1.27; 25 12.7,-1.27; 26 12.7,1.27; 27 15.24,-1.27; 28 15.24,1.27; 29 17.78,-1.27; 30 17.78,1.27
1X02 = drill 1.016 long: 1 -1.27,0; 2 1.27,0
RESC1608X60 = smd 0.799 x 0.974: 1 -0.815,0; 2 0.815,0
R0603 = smd 1 x 1.1: 1 -0.85,0; 2 0.85,0
21-0055H_16_MXM = smd 1.46 x 0.356: 1 -2.724,2.223; 2 -2.724,1.587; 3 -2.724,0.953; 4 -2.724,0.318; 5 -2.724,-0.318; 6 -2.724,-0.953; 7 -2.724,-1.587; 8 -2.724,-2.223; 9 2.724,-2.223; 10 2.724,-1.587; 11 2.724,-0.953; 12 2.724,-0.318; 13 2.724,0.318; 14 2.724,0.953; 15 2.724,1.587; 16 2.724,2.223
QRE1113 = smd 1.2 x 0.6: 1 -1.8,-0.9; 2 1.8,-0.9; 3 1.8,0.9; 4 -1.8,0.9
TEXAS_SOT23-5 = smd 0.55 x 1.2: 1 -0.95,-1.3; 2 0,-1.3; 3 0.95,-1.3; 4 0.95,1.3; 5 -0.95,1.3
DC-DC_CONVERTER_78XX = drill 0.8: GND 0,0; VIN -2.54,0; VOUT 2.54,0
SOP65P640X120-24N = smd 1.57 x 0.41: 1 -2.87,3.575; 2 -2.87,2.925; 3 -2.87,2.275; 4 -2.87,1.625; 5 -2.87,0.975; 6 -2.87,0.325; 7 -2.87,-0.325; 8 -2.87,-0.975; 9 -2.87,-1.625; 10 -2.87,-2.275; 11 -2.87,-2.925; 12 -2.87,-3.575; 13 2.87,-3.575; 14 2.87,-2.925; 15 2.87,-2.275; 16 2.87,-1.625; 17 2.87,-0.975; 18 2.87,-0.325; 19 2.87,0.325; 20 2.87,0.975; 21 2.87,1.625; 22 2.87,2.275; 23 2.87,2.925; 24 2.87,3.575
CMR0512S3C = drill 0.8 square: P$1 -7.62,0; P$2 -5.08,0; P$3 0,0; P$4 2.54,0; P$5 5.08,0
POT-PTH-ALPS = drill 1 pad 1.88 square: P$1 7,-2.5; P$2 7,0; P$3 7,2.5 | drill 2 octagon: P$4 0,-4.4; P$5 0,4.4
PAK100/2500-20 = drill 1 pad 1.422: 1 -11.43,-1.27; 2 -11.43,1.27; 3 -8.89,-1.27; 4 -8.89,1.27; 5 -6.35,-1.27; 6 -6.35,1.27; 7 -3.81,-1.27; 8 -3.81,1.27; 9 -1.27,-1.27; 10 -1.27,1.27; 11 1.27,-1.27; 12 1.27,1.27; 13 3.81,-1.27; 14 3.81,1.27; 15 6.35,-1.27; 16 6.35,1.27; 17 8.89,-1.27; 18 8.89,1.27; 19 11.43,-1.27; 20 11.43,1.27
PAK100/2500-16 = drill 1 pad 1.422: 1 -8.89,-1.27; 2 -8.89,1.27; 3 -6.35,-1.27; 4 -6.35,1.27; 5 -3.81,-1.27; 6 -3.81,1.27; 7 -1.27,-1.27; 8 -1.27,1.27; 9 1.27,-1.27; 10 1.27,1.27; 11 3.81,-1.27; 12 3.81,1.27; 13 6.35,-1.27; 14 6.35,1.27; 15 8.89,-1.27; 16 8.89,1.27

### Placement (x,y rotation side)
3V3A_0A  181.36,11.94 0 top
3V3A_0B  262.13,11.68 0 top
3V3A_0C  100.33,11.68 0 top
5V/1  43.69,8.64 0 top
+12VA  37.34,32.51 0 top
+15VA  23.62,29.97 180 top
-12VA  37.34,35.05 180 top
-15VA  23.62,32.51 180 top
C1  57.66,7.11 90 top
C2  57.66,10.67 270 top
C5  34.8,31.5 270 top
C6  45.21,36.58 180 top
C7  44.7,46.74 0 top
C8  34.8,36.07 270 top
C9  14.73,23.37 270 top
C10  14.73,18.8 270 top
C11  14.48,11.18 90 top
C15  87.38,137.92 270 top
C16  88.9,137.92 270 top
C21  96.27,137.41 0 top
C22  96.27,138.68 0 top
C51  32.51,31.5 270 top
C52  32.51,36.07 270 top
C53  17.02,23.37 270 top
C54  17.02,18.8 270 top
C119  55.63,10.67 270 top
C120  55.65,7.16 90 top
C121  17.02,11.18 90 top
C123  103.12,137.41 0 top
C158  35.56,42.93 0 top
C162  184.15,-26.42 90 top  (outside the outline)
C164  178.82,-38.61 180 top  (outside the outline)
C182  89.66,133.35 270 top
DGND4  [1X01']  87.12,132.08 0 top
DGND5  43.69,6.1 180 top
FB_IN  4.32,18.29 0 top
IC1  44.96,41.66 180 top
IC5  27.69,31.5 180 top
IC6  27.69,34.8 0 top
J1  375.41,-17.53 90 bottom  (outside the outline)
J2  16.76,34.29 270 top
J36  44.2,54.61 0 top
JP1  106.68,11.94 180 top
JP2  187.71,12.45 180 top
JP3  63.5,29.46 90 top
JP4  144.53,29.72 90 top
JP5  225.3,29.46 90 top
JP6  129.54,29.46 90 top
JP7  210.57,29.72 90 top
JP8  291.34,29.46 90 top
JP9  105.38,7.82 0 top
JP10  186.39,8.1 0 top
JP11  267.13,7.85 0 top
JP12  -12.95,-32.51 90 top  (outside the outline)
JP13  37.85,-32.51 90 top  (outside the outline)
JP14  34.04,53.85 0 top
JP15  268.48,12.45 180 top
JP16  88.65,-32.51 90 top  (outside the outline)
JP17  139.45,-32.51 90 top  (outside the outline)
JP18  190.25,-32.51 90 top  (outside the outline)
JP19  241.05,-32.51 90 top  (outside the outline)
JP20  291.85,-32.51 90 top  (outside the outline)
JP21  342.65,-32.51 90 top  (outside the outline)
JP22  -46.48,99.31 90 top  (outside the outline)
JP23  -35.05,99.57 90 top  (outside the outline)
JP24  11.94,99.57 90 top
JP25  -23.62,99.57 90 top  (outside the outline)
MONO_OUT  4.32,45.72 0 top
OPT_PWR  [1X01']  87.12,134.62 0 top
R1  183.39,144.27 90 top
R2  176.53,140.72 270 top
R3  174.75,144.27 90 top
R4  51.31,45.97 0 top
R5  41.4,34.8 0 top
R6  167.64,140.72 270 top
R7  166.62,144.27 90 top
R8  159.26,140.72 270 top
R10  33.53,48.26 90 top
R11  36.32,47.75 180 top
R12  157.99,144.27 90 top
R16  149.86,140.72 270 top
R17  149.1,144.53 90 top
R18  141.22,140.46 270 top
R19  140.46,144.27 90 top
R20  132.59,140.21 270 top
R21  131.83,144.27 90 top
R22  123.95,140.21 270 top
R23  87.88,144.02 90 top
R24  82.3,138.18 270 top
R25  122.94,144.02 90 top
R26  114.81,140.72 270 top
R27  114.3,144.02 90 top
R28  106.17,140.72 270 top
R29  105.41,144.27 90 top
R30  98.3,141.73 270 top
R31  96.52,144.02 90 top
R32  88.65,140.72 270 top
R33  41.4,32.51 0 top
R34  48.51,34.54 180 top
R35  48.51,32.26 180 top
R37  41.4,37.08 180 top
R38  48.51,36.83 0 top
R110  29.46,8.64 0 top
R111  29.46,16 0 top
R112  42.93,13.97 180 top
R125  180.85,-27.69 180 top  (outside the outline)
R134  178.05,-26.92 90 top  (outside the outline)
R159  48.01,46.23 0 top
R160  47.24,48.77 270 top
R161  49.28,48.77 270 top
R162  51.31,48.77 270 top
R185  26.67,18.54 90 top
R208  42.67,19.05 180 top
R209  42.42,23.62 180 top
STEREO_OUT  4.32,32.51 0 top
U1  332.74,-18.54 270 top  (outside the outline)
U3  180.09,142.49 0 top
U4  171.45,142.49 0 top
U5  162.81,142.49 0 top
U6  153.92,142.49 0 top
U7  145.29,142.49 0 top
U8  136.4,142.49 0 top
U9  127.76,142.49 0 top
U10  118.87,142.49 0 top
U11  110.24,142.49 0 top
U12  101.6,142.49 0 top
U13  92.71,142.24 0 top
U14  84.07,142.24 0 top
U16  91.95,137.92 270 top
U17  52.32,9.14 90 top
U20  181.1,-33.02 0 top  (outside the outline)
U$3  18.8,18.54 90 top
VR1  2.54,-18.03 270 top  (outside the outline)
VR2  53.34,-18.03 270 top  (outside the outline)
VR3  104.14,-18.03 270 top  (outside the outline)
VR4  154.94,-18.03 270 top  (outside the outline)
VR5  205.74,-18.03 270 top  (outside the outline)
VR6  256.54,-18.03 270 top  (outside the outline)
VR7  307.34,-18.03 270 top  (outside the outline)
VR8  358.14,-18.03 270 top  (outside the outline)
VREGGND  26.67,13.46 180 top
VREGIN  26.67,10.92 180 top
X6  -25.65,78.74 0 top  (outside the outline)
X7  36.32,15.24 90 top
X10  102.11,133.86 0 bottom

### Tracks (layer width: path | path; a pad name or v marks a point on that pad's centre or on a via)
3V3D3  (10 unrouted)
  Top 0.254: C162.1 184.15,-29.27 U20.24
  Top 0.508: C162.1 183.92,-27.69 R125.1 181.7,-26.76 181.01,-26.07 R134.2
+3.3V  (8 unrouted)
+5V/1
  Top 0.61: U17.VOUT 52.49,11.52 55.12,11.52 C119.1 C2.1
  pour Route15: 59.18,8.13 42.67,8.13 54.36,21.34 106.68,21.34 128.27,42.93 132.59,42.93 132.59,26.42 138.43,20.57 190.75,20.57 207.52,37.34 207.52,42.67 208.03,43.18 213.11,43.18 215.39,40.89 215.39,30.23 214.12,28.96 214.12,27.18 222.25,19.05 232.66,19.05 236.98,23.37 236.98,39.12 253.24,55.37 294.89,55.37 294.89,2.54 60.71,2.54 60.71,6.6
+9V  (via drill 0.35)  (1 unrouted)
  Top 0.254: C51.1 32.51,32.51 | 43.87,46.18 44.32,45.72 44.83,45.72 45,45.55 45,44.42 IC1.4
  Top 0.61: IC5.OUT 29.21,31.75 31.92,32.26 C51.1 | +12VA.1 32.51,32.51 | 43.87,46.18 43.85,46.19 C7.1 43.94,46.82 43.94,48.01 44.2,48.26 v44.96,48.26
  Bottom 0.61: +12VA.1 37.59,32.77 43.94,32.77 45.47,34.29 45.47,35.31 42.93,37.85 42.93,44.45 44.96,46.48 v44.96,48.26
  pour Route15 (isolate 0.254): 22.86,33.53 46.99,33.53 50.29,36.83 50.29,40.13 48.77,41.66 32.77,41.66 31.24,43.18 31.24,49.28 22.35,49.28 22.35,55.37 22.61,55.63 249.68,55.63 249.68,54.86 235.2,40.39 235.2,24.13 231.9,20.83 223.52,20.83 216.92,27.43 216.92,42.16 214.12,44.96 207.52,44.96 204.72,42.16 204.72,37.85 189.23,22.35 140.46,22.35 135.13,27.69 135.13,43.18 133.6,44.7 125.73,44.7 123.7,42.67 114.42,33.53 113.28,32 104.9,23.62 59.69,23.62 49.78,33.53
+12V
  Top 0.61: U17.VIN 54.1,6.6 54.39,6.31 C120.1 57.61,6.31 C1.1
  Top 1.016: R110.2 31.75,7.2 31.75,4.83 32.51,4.06 36.58,4.06 37.59,5.08 X7.1
  pour Route15: 29.46,8.89 39.12,8.89 41.66,6.35 57.66,6.35 58.67,5.33 58.67,2.79 29.21,2.79 26.42,5.59 26.42,6.1 29.21,8.89
-9V  (via drill 0.35)
  Top 0.254: IC1.11 44.96,37.59 44.36,37 C6.2
  Top 0.61: -12VA.1 37.17,35.22 C8.2 C52.2 32.09,34.8 IC6.OUT | C6.2 44.36,34.96 44.2,34.8 v43.94,34.8
  Bottom 0.61: v43.94,34.8 37.59,34.8 -12VA.1
  pour Route15 (isolate 0.254): 30.48,48.51 22.35,48.51 22.35,44.45 32.26,34.54 46.74,34.54 49.53,37.34 49.53,39.88 48.51,40.89 32.26,40.89 30.48,42.67
A_IN  (via drill 0.35)  (1 unrouted)
  Top 0.508: JP5.2 223.27,25.65 221.74,27.18 221.74,41.66 217.68,45.72 201.68,45.72 179.83,23.88 144.02,23.88 143.26,24.64 JP4.2 141.73,25.91 138.43,29.21 138.43,48.26 134.11,52.58 96.27,52.58 67.82,24.13 62.48,24.13 62.23,24.38 JP3.2 59.69,25.65 56.64,28.7 56.64,39.62 v56.39,39.62
  Bottom 0.508: v56.39,39.62 55.12,39.62 v51.05,43.69
A_OUT1  (via drill 0.35)
  Top 0.254: 46.99,49.36 R160.1
  Top 0.406: R160.1 47.24,50.8 47.75,51.31 v48.26,51.31 | R33.1 40.55,31.5 41.06,30.99 43.43,30.99 v43.69,31.24
  Bottom 0.406: 61.98,33.53 62.1,33.4 | 62.1,33.4 JP3.8 | 62.1,33.4 62.1,40.77 51.56,51.31 v48.26,51.31 48.26,47.75 43.94,43.43 43.94,38.86 46.99,35.81 46.99,33.78 44.7,31.5 43.94,31.5 v43.69,31.24
A_OUT2  (via drill 0.35)
  Top 0.305: v50.55,52.32 46.74,52.32 39.12,44.7 36.32,44.7 35.56,43.94 35.56,41.15 36.83,39.88 36.83,37.59 38.1,36.32 39.12,36.32 40.39,35.05 40.39,34.8
  Top 0.406: v50.55,52.32 50.55,51.82 49.28,50.55 R161.1 | R35.1 49.36,30.82 48.51,29.97 39.88,29.97 39.12,30.73 39.12,34.29 39.62,34.8 40.39,34.8 R5.1
  Bottom 0.406: JP4.8 143.26,41.4 133.21,51.45 89.04,51.45 82.04,44.45 60.2,44.45 52.32,52.32 v50.55,52.32
A_OUT3  (via drill 0.55)
  Top 0.406: v56.39,52.83 54.52,52.83 R162.1 52.49,49.62 53.34,48.77 53.34,35.56 52.07,34.29 49.62,34.29 R34.1
  Bottom 0.406: JP5.8 224.03,39.37 217.68,45.72 207.26,45.72 202.69,50.29 140.46,50.29 136.4,54.36 68.83,54.36 63.75,49.28 59.94,49.28 v56.39,52.83
AGND1  (8 unrouted)
AGND3  (7 unrouted)
AGND5  (via drill 0.35, 1)  (7 unrouted)
  Top 0.254: 16.52,22.35 16.76,22.35 16.89,22.48 17.02,22.61 C53.2 17.02,22.1 | 16.52,19.81 16.76,19.81 17.02,19.56 C54.1 17.02,20.07 | 32.76,31 C51.2 | 45.59,46.98 IC1.3 | C6.1 46.06,37 45.59,37.46 IC1.12 45.59,40.01 45.47,40.13 44.45,40.13 44.32,40.01 IC1.10
  Top 0.406: R11.1 37.17,49.11 v37.34,49.28 | 16.85,22.52 16.89,22.48
  Top 0.61: 18.03,21.08 U$3.P$4 | 17.02,22.1 18.03,21.08 | 17.02,20.07 18.03,21.08 | C9.2 16.85,22.52 | C10.1 16.6,19.65 16.76,19.81 | C5.2 C51.2 31.46,29.59 IC5.GND | C8.1 C52.1
  Top 0.813: R185.2 v26.67,21.59
  pour Route2: 14.22,17.02 21.34,17.02 24.13,19.81 29.21,19.81 30.23,20.83 30.23,29.72 31.24,30.73 40.64,30.73 42.42,28.96 49.53,28.96 55.12,23.37 105.41,23.37 126.49,44.45 134.11,44.45 134.37,44.2 134.37,27.18 139.19,22.35 189.74,22.35 205.74,38.35 205.74,43.43 207.01,44.7 214.38,44.7 217.17,41.91 217.17,29.46 215.9,28.19 223.27,20.83 231.65,20.83 234.7,23.88 234.7,39.12 216.66,57.15 12.95,57.15 12.95,18.29
B_IN1  (via drill 0.35)
  Top 0.254: IC1.7 IC1.6 42.93,44.37 | 67.56,40.89 67.82,40.89 67.82,26.92 66.55,25.65 JP3.1 | JP4.1 147.32,25.91 149.35,27.94 149.35,39.88 149.22,40.01
  Top 0.508: v42.42,45.72 42.42,44.88 42.93,44.37 | 67.56,40.89 v61.98,46.48 86.11,46.48 93.85,54.23 135,54.23 149.22,40.01 193.42,40.01 206.5,53.09 215.14,53.09 228.85,39.37 228.85,26.67 227.84,25.65 JP5.1
  Bottom 0.508: v42.42,45.72 42.42,47.41 43.98,48.97 44.14,48.97 49.02,53.85 52.83,53.85 60.2,46.48 v61.98,46.48
CGND  (31 unrouted)
  pour Route2: 185.67,130.05 185.67,146.81 79.5,146.81 79.5,130.05
DGND4  (1 unrouted)
  Top 0.61: C119.2 C2.2 C1.2 57.61,8.01 C120.2 55.63,8.04 C119.2 | C119.2 54.95,9.14 U17.GND
  Top 0.813: R185.1 29.55,17.69 30.48,16.76 30.48,16.17 R111.2 | X7.4 34.29,8.89 33.02,10.16 33.02,11.68 31.24,13.46
  pour Route2: 12.95,1.27 12.95,14.99 12.7,15.24 22.1,15.24 25.4,18.54 30.23,18.54 31.75,20.07 31.75,28.96 40.39,28.96 40.64,29.21 42.16,27.69 49.02,27.69 54.61,22.1 106.43,22.1 127.51,43.18 127.51,43.43 133.1,43.43 133.1,26.67 138.68,21.08 190.5,21.08 207.01,37.59 207.01,42.93 207.77,43.69 213.36,43.69 215.9,41.15 215.9,29.97 214.63,28.7 214.63,27.43 222.5,19.56 232.66,19.56 236.47,23.37 236.47,39.37 253.49,56.39 295.66,56.39 295.66,1.78 295.15,1.27
GND-ISO  (10 unrouted)
  Top 0.254: C162.2 184.94,-24.92 186.44,-26.42 186.44,-28.7 185.67,-29.46 185.67,-30.99 185.27,-31.39 U20.21 183.88,-31.31 181.29,-31.31 181.23,-31.24 179.83,-31.24 179.58,-30.99 179.58,-29.72 179.31,-29.45 U20.1 | U20.12 178.23,-38.32 C164.2
MONO_OUTPUT
  Top 0.305: IC1.1 48.78,44.37 48.86,44.45
  Top 0.508: C158.+ 40.89,42.93 42.67,41.15 45.72,41.15 48.86,44.28 48.86,44.45 R159.2 50.2,46.23 R4.1
N$1  (1 unrouted)
N$2  (1 unrouted)
N$3
  Top 0.254: U1.5 332.42,-13.91 329.95,-11.43 5.59,-11.43 2.54,-14.48 VR1.P$2
N$4
  Top 0.254: U1.6 331.79,-13.95 330.03,-12.19 57.15,-12.19 53.34,-16 VR2.P$2
N$5
  Top 0.254: U1.7 331.15,-14.16 329.95,-12.95 106.43,-12.95 103.89,-15.49 103.89,-24.78 VR3.P$2
N$6
  Top 0.254: U1.8 330.52,-14.79 329.44,-13.72 157.48,-13.72 154.94,-16.26 VR4.P$2
N$7  (1 unrouted)
N$8  (via drill 0.35)
  Top 0.254: U1.9 319.21,-21.27 v318.01,-20.07
  Bottom 0.254: v318.01,-20.07 315.72,-22.35 207.52,-22.35 205.74,-24.13 VR5.P$2
N$9
  Top 0.254: U1.10 331.15,-23.43 327.91,-26.67 300.23,-26.67 297.94,-24.38 263.65,-24.38 261.87,-22.61 257.3,-22.61 256.54,-23.37 VR6.P$2
N$11
  Top 0.254: U1.11 331.72,-21.2 331.72,-19.05 331.22,-18.54 316.74,-18.54 312.93,-22.35 308.61,-22.35 307.34,-23.62 VR7.P$2
N$12
  Top 0.254: VR8.P$2 358.14,-23.62 357.38,-22.86 352.04,-22.86 348.49,-19.3 332.74,-19.3 332.42,-19.62 U1.12
N$13  (via drill 0.35)
  Top 0.254: U1.14 333.76,-21.33 333.76,-23.88 | J1.2 371.87,-18.53 362.46,-27.94 353.06,-27.94 349.25,-24.13 v333.5,-24.13
  Top 0.406: U20.23 182.24,-30.09 182.12,-29.97 v181.86,-29.97 | v333.5,-24.13 333.76,-23.88
  Bottom 0.406: v181.86,-29.97 184.66,-29.97 189.23,-25.4 197.87,-25.4 200.15,-27.69 211.84,-27.69 213.36,-26.16 250.44,-26.16 251.71,-27.43 264.67,-27.43 266.7,-25.4 294.39,-25.4 296.42,-27.43 330.71,-27.43 333.76,-24.38 v333.5,-24.13
N$14  (via drill 0.35)
  Top 0.254: U20.22 181.11,-30.74 180.34,-29.97 v180.47,-29.84 | U1.13 333.06,-23.3 332.49,-23.88 v332.49,-24.13 332.49,-24.89 332.74,-25.15 348.49,-25.15 352.04,-28.7 364.24,-28.7 372.41,-20.53 J1.1
  Bottom 0.254: v180.47,-29.84 180.7,-29.84 181.56,-30.71 184.94,-30.71 189.69,-25.96 197.64,-25.96 199.92,-28.24 212.07,-28.24 213.59,-26.72 249.99,-26.72 251.46,-28.19 264.92,-28.19 266.95,-26.16 293.88,-26.16 295.91,-28.19 331.22,-28.19 334.52,-24.89 334.52,-23.88 333.76,-23.11 332.99,-23.11 332.49,-23.62 v332.49,-24.13
N$15  (1 unrouted)
N$16
  Top 0.254: IC1.9 43.69,37.85 42.93,37.08 R37.1 R5.2 R33.2
N$17
  Top 0.254: IC1.13 46.23,38.09 46.24,38.09 47.5,36.83 R38.1 R34.2 R35.2
N$18  (via drill 0.35)
  Top 0.254: IC1.14 47.19,38.61 48.51,38.61 49.36,37.76 R38.2
  Top 1.016: v51.05,37.34 50.55,36.83 R38.2
  Bottom 1.016: STEREO_OUT.TIP 9.83,27.92 20.83,27.92 | 20.83,27.92 30.46,27.92 32,29.46 41.66,29.46 42.42,28.7 46.99,28.7 51.82,33.53 51.82,37.08 51.56,37.34 v51.05,37.34 | J2.2 16.78,35.31 19.3,35.31 20.83,33.78 20.83,27.92
N$19  (via drill 0.35)
  Top 0.254: IC1.8 42.72,38.61 41.4,38.61 40.55,37.76 R37.2
  Top 1.016: v38.1,38.35 39.28,38.35 R37.2
  Bottom 1.016: STEREO_OUT.RING 17.09,37.61 | v38.1,38.35 37.59,38.86 22.61,38.86 21.36,37.61 18.29,37.61 17.09,37.61 | J2.1 17.09,37.61
N$20
  Bottom 0.406: JP24.1 11.97,98.27 11.93,86.87 -7.47,86.87 -12.35,80.77 -12.35,79.35 X6.19
N$21  (via drill 0.35)
  Top 0.254: v45.34,42.57 44.86,42.57 44.32,43.1 IC1.5
  Top 0.61: J2.3 16.75,33.27 15.24,33.27 11.68,29.72 11.68,13.97 10.9,13.19 FB_IN.TIP
  Bottom 1.016: FB_IN.TIP 12.43,13.19 15.49,16.26 15.49,25.15 16,25.65 31.75,25.65 33.27,27.18 49.02,27.18 53.59,31.75 53.59,38.1 50.29,41.4 46.48,41.4 45.34,42.54 v45.34,42.57
N$22
  Bottom 0.406: JP25.1 -20.32,95 -20.32,89.92 -14.22,83.82 X6.20
N$23
  Bottom 0.406: JP23.1 -37.85,95.5 -37.85,89.92 -35.56,87.63 -20.32,87.63 -16.76,84.07 X6.18
N$24  (1 unrouted)
  Bottom 0.406: -46.48,98.3 -46.48,89.66 -42.93,86.11 -20.83,86.11 -18.03,83.31 -18.03,78.74 X6.17
N$27
  Top 0.254: R162.2 R161.2 R160.2 47.24,46.32 R159.1 46.23,45.3 IC1.2
N$33  (1 unrouted)
N$35  (1 unrouted)
N$36  (1 unrouted)
N$37  (1 unrouted)
N$38  (1 unrouted)
N$39  (1 unrouted)
N$40  (1 unrouted)
N$41  (1 unrouted)
N$42  (1 unrouted)
N$105  (2 unrouted)
  Top 0.254: C121.2 17.02,11.94 16.76,12.19 16,12.19
  Top 0.61: VREGGND.1 U$3.P$2 16.51,13.46 16,12.95 16,12.19
N$106  (2 unrouted)
  Top 0.254: C121.1 17.02,10.41
  Top 0.61: VREGIN.1 U$3.P$1 18.29,10.41 17.02,10.41 16.52,10.41
N$174
  Top 0.254: R134.1 177.2,-27.77 176.53,-28.45 176.53,-30.48 176.8,-30.74 U20.3
N$249
  Top 0.61: R10.1 33.53,43.29 C158.-
N$265
  Top 0.406: 35.22,49.11 35.31,49.02 R11.2
  Top 0.61: 35.22,49.11 R10.2 32.77,49.87 JP14.1 | J36.1 38.4,51.82 37.85,51.82 35.47,49.44 R11.2
  Top 1.016: R10.2 33.06,49.57 24.11,40.62 MONO_OUT.TIP
  Bottom 0.61: J36.1 J36.2
N$284
  Top 0.254: R209.2 41.48,23.71 41.31,23.71 40.89,24.13 X7.15
N$293
  Top 0.254: X7.11 R208.2
N$294
  Top 0.254: X7.7 R112.2
N$298
  Top 0.254: JP1.4 102.87,11.18 101.6,9.91 101.6,7.8 JP9.13
  Top 0.305: JP9.13 102.87,6.53
N$299
  Top 0.254: 3V3A_0C.1 100.33,9.12 JP9.12
N$300
  Top 0.254: JP1.2 107.95,11.18 106.68,9.91 106.68,7.37 105.87,6.55 JP9.15
N$309  (1 unrouted)
N$310
  Bottom 0.254: 3V3A_0B.1 262.13,9.2 JP11.12
OPT1  (2 unrouted)
OPT2  (2 unrouted)
OPT3  (2 unrouted)
OPT4  (2 unrouted)
OPT5  (2 unrouted)
OPT6  (2 unrouted)
OPT7  (2 unrouted)
OPT8  (2 unrouted)
OPT9  (2 unrouted)
OPT10  (2 unrouted)
OPT11  (2 unrouted)
OPT12  (2 unrouted)
OPT_PWR  (16 unrouted)
  pour Route15: 79.5,146.81 79.5,142.75 185.42,142.75 185.42,146.81
OPT_PWR_EN  (1 unrouted)
OPT_PWR_SW  (16 unrouted)
  pour Route15: 79.5,141.73 79.5,130.05 185.42,130.05 185.42,141.73
PA0-2
  Bottom 0.305: JP2.4 183.9,11.43 182.63,10.16 182.63,8.05 JP10.13
PA0-3
  Bottom 0.305: JP15.4 264.67,11.18 263.4,9.91 263.4,7.77 JP11.13
PA1-2
  Bottom 0.305: JP2.3 186.44,11.96 JP10.14
PA1-3
  Bottom 0.305: JP11.14 264.59,9.83 JP15.3
PA1_1
  Top 0.254: JP1.3 105.41,11.66 JP9.14
PA2-2
  Bottom 0.305: JP2.2 188.98,11.18 187.71,9.91 187.71,7.62 186.92,6.83 JP10.15
PA2-3
  Bottom 0.305: JP11.15 268.48,7.93 268.48,11.18 JP15.2
PA3-2
  Bottom 0.305: JP2.1 190.75,13.21 190.75,13.97 189.99,14.73 188.21,14.73 187.71,14.22 187.71,10.69 JP10.16
PA3-3
  Top 0.305: JP15.1 270.26,10.41 267.72,10.41 267.13,9.83 JP11.16
PA3_1
  Bottom 0.254: JP1.1 109.98,12.45 109.98,13.21 109.22,13.97 106.93,13.97 106.68,13.72 106.68,10.39 JP9.16
REG+12V
  Top 0.254: 17.01,24.12 C53.1 17.02,24.13
  Top 0.61: 17.02,24.13 18.29,24.13 U$3.P$5 | C53.1 C9.1
  Top 0.813: IC5.IN 24.89,29.97 +15VA.1 23.62,28.45 U$3.P$5
REG-12V  (1 unrouted)
  Top 0.254: U$3.P$3 17.02,18.54 C54.2 17.01,18.55
  Top 0.61: IC6.IN 25.53,36.7 23.62,34.8 -15VA.1
  Top 0.813: -15VA.1 23.37,32.51 21.84,30.99 21.84,28.96 20.32,27.43 20.07,27.43 18.54,25.91 13.72,25.91 12.95,25.15 12.95,18.8 13.47,18.28 18.54,18.28 U$3.P$3
SC0
  Top 0.406: JP12.3 9.91,-31.24 14.48,-26.67 42.93,-26.67 45.97,-29.72 59.69,-29.72 62.74,-26.67 94.74,-26.67 97.28,-29.21 111.25,-29.21 113.54,-26.92 145.8,-26.92 150.9,-32.03 177.3,-32.03 178.22,-32.03 U20.5
SC1  (via drill 0.35)
  Top 0.406: v149.61,-34.29 150.55,-33.34 U20.7
  Bottom 0.406: JP13.3 38.1,-30.99 59.18,-30.99 63.5,-26.67 95,-26.67 97.28,-28.96 111.51,-28.96 113.54,-26.92 141.48,-26.92 148.84,-34.29 v149.61,-34.29
SC2  (via drill 0.35)
  Top 0.406: v153.42,-36.32 155.09,-34.64 U20.9
  Bottom 0.406: JP16.3 94.23,-31.24 102.36,-39.37 150.37,-39.37 v153.42,-36.32
SC3
  Top 0.406: U20.11 168.66,-35.95 166.63,-37.97 166.5,-37.97 166.37,-38.1 150.62,-38.1 143.51,-30.99 139.7,-30.99 JP17.3
SC4  (via drill 0.35)
  Top 0.254: v187.2,-31.5 187.53,-31.83 187.53,-35.44 187.02,-35.95 U20.14
  Bottom 0.254: JP18.3 189.99,-31.5 v187.2,-31.5
SC5  (via drill 0.35)
  Top 0.254: U20.16 182.02,-34.64 v181.1,-35.56
  Bottom 0.254: v181.1,-35.56 181.1,-37.08 182.12,-38.1 188.04,-38.1 188.27,-38.33 188.44,-38.33 188.47,-38.35 233.68,-38.35 238.76,-33.27 238.76,-31.75 239.27,-31.24 JP19.3
SC6  (via drill 0.35)
  Top 0.254: v181.86,-33.02 182.12,-33.27 183.9,-33.27 U20.18
  Bottom 0.254: v181.86,-33.02 180.59,-33.02 180.34,-33.27 180.34,-34.11 179.6,-34.85 179.6,-37.03 181.94,-39.37 279.65,-39.37 287.78,-31.24 JP20.3
SC7
  Top 0.254: U20.20 185.63,-32.05 186.44,-31.24 186.44,-30.23 188.21,-28.45 188.21,-27.94 188.98,-27.18 247.4,-27.18 248.41,-28.19 287.27,-28.19 289.05,-26.42 296.16,-26.42 297.94,-28.19 336.8,-28.19 339.85,-31.24 JP21.3
SD0
  Top 0.406: U20.4 152.05,-31.39 146.56,-25.91 112.27,-25.91 110.49,-27.69 98.04,-27.69 95.76,-25.4 61.72,-25.4 58.93,-28.19 47.24,-28.19 44.45,-25.4 13.46,-25.4 10.16,-28.7 JP12.4
SD1  (via drill 0.35)
  Top 0.406: U20.6 149.28,-32.7 v149.1,-32.51
  Bottom 0.406: v149.1,-32.51 142.24,-25.65 112.52,-25.65 110.24,-27.94 98.3,-27.94 95.76,-25.4 61.98,-25.4 58.67,-28.7 JP13.4
SD2  (via drill 0.35)
  Top 0.406: U20.8 152.95,-33.99 v151.38,-35.56
  Bottom 0.406: v151.38,-35.56 148.59,-38.35 103.12,-38.35 93.47,-28.7 JP16.4
SD3
  Top 0.406: JP17.4 142.24,-28.7 150.88,-37.34 166.37,-37.34 168.41,-35.3 U20.10
SD4
  Top 0.254: U20.13 187.18,-36.59 188.21,-35.56 188.21,-29.46 188.98,-28.7 JP18.4
SD5  (via drill 0.35)
  Top 0.254: U20.15 183.96,-35.31 182.63,-35.31 182.12,-35.81 v182.12,-36.32
  Bottom 0.254: v182.12,-36.32 182.12,-37.08 182.37,-37.34 187.96,-37.34 188.47,-37.85 233.17,-37.85 237.74,-33.27 237.74,-29.21 238.25,-28.7 JP19.4
SD6  (via drill 0.35)
  Top 0.254: U20.17 181.14,-33.99 v181.1,-34.04
  Bottom 0.254: v181.1,-34.04 180.09,-35.05 180.09,-36.83 182.12,-38.86 279.15,-38.86 289.31,-28.7 JP20.4
SD7  (via drill 0.35)
  Top 0.254: U20.19 182.81,-32.7 182.12,-32 v180.59,-32
  Bottom 0.254: v180.59,-32 179.07,-33.53 179.07,-37.18 181.74,-39.85 332.51,-39.85 336.04,-36.32 336.04,-31.5 338.84,-28.7 JP21.4
SPI1_CS  (via drill 0.35)
  Top 0.254: X7.9 43.94,16.51 46.99,17.53 107.7,17.53 v108.59,16.64 112.01,13.21 112.01,10.16 111.76,9.91 111.76,8.38 111.25,7.87 109.25,7.87 JP9.17 | v177.55,12.19 177.55,12.45 179.83,14.73 192.53,14.73 193.55,13.72 193.55,11.68 192.43,10.57 191.05,10.57 190.98,10.64 190.47,10.64 190.25,10.41 190.25,8.13 190.22,8.13 JP10.17 190.93,4.83 v197.87,4.83 | v256.69,4.23 235.8,4.23 231.14,8.89 v231.01,8.76
  Bottom 0.254: v177.55,12.19 173.48,16.26 108.71,16.26 108.46,16.51 v108.59,16.64 | JP11.17 266.14,3.05 258.06,3.05 256.88,4.23 v256.69,4.23 | v231.01,8.76 229.74,8.76 227.33,11.18 210.82,11.18 204.47,4.83 v197.87,4.83
SPI1_MISO  (via drill 0.35)
  Top 0.254: R208.1 108.71,19.05 114.3,13.46 114.3,8.13 114.05,7.87 112.27,7.87 110.95,6.55 JP9.19 | v170.18,12.45 173.99,16.26 193.55,16.26 | 193.55,16.26 194.06,16.26 v195.33,14.99 | v194.06,16.76 193.55,16.26
  Bottom 0.254: JP9.19 110.47,4.85 111.25,4.06 136.65,4.06 145.03,12.45 v170.18,12.45 | v195.33,14.99 195.33,13.46 192.79,10.92 192.79,7.62 192,6.83 JP10.19 | JP11.19 273.51,7.87 273.56,7.87 273.56,10.67 274.07,11.18 274.07,14.73 272.03,16.76 v194.06,16.76
SPI1_MOSI  (via drill 0.35)
  Top 0.254: X7.12 36.32,17.78 45.36,17.78 47.22,18.34 108.15,18.34 v113.28,13.21 | v179.83,3.3 179.07,2.54 151.38,2.54 142.49,11.43 116.08,11.43 115.82,11.68 v115.57,11.43 | JP11.20 274.07,10.97 274.07,14.48 273.81,14.73 197.87,14.73 v197.61,14.48
  Bottom 0.254: v113.28,13.21 113.28,11.94 112.78,11.43 | JP9.20 110.47,9.12 112.78,11.43 | JP10.20 191.47,8.84 190.25,7.62 190.25,5.08 | 190.25,5.08 189.74,4.57 180.59,4.57 179.83,3.81 v179.83,3.3 | v115.57,11.43 112.78,11.43 | v197.61,14.48 197.61,13.46 195.33,11.18 195.33,5.84 194.31,4.83 190.5,4.83 190.25,5.08
SPI1_SCK  (via drill 0.35)
  Top 0.254: X7.10 36.32,15.24 43.43,15.24 47.24,16.76 106.17,16.76 109.22,13.72 109.22,10.36 107.96,9.09 JP9.18 | v175.51,3.81 177.55,5.84 177.55,7.87 177.8,8.13 187.71,8.13 188.93,9.35 JP10.18 187.71,8.15 187.71,5.59 189.23,4.06 204.98,4.06 211.07,10.16 244.86,10.16 247.4,7.62 247.9,7.62 248.16,7.87 269.24,7.87 269.67,8.31 JP11.18
  Bottom 0.254: JP9.18 106.71,7.87 106.68,7.87 106.68,4.32 107.7,3.3 137.06,3.3 142.05,8.29 144.31,8.29 149.3,3.3 174.75,3.3 175.26,3.81 v175.51,3.81
SPI2_CS
  Top 0.254: JP8.3 291.34,21.84 288.8,21.84 284.48,17.53 216.41,17.53 213.11,20.83 JP7.3 211.84,21.34 211.07,22.1 207.26,22.1 204.47,19.3 134.11,19.3 132.84,20.57 JP6.3 130.56,20.57 129.54,21.59 127,21.59 125.86,20.45 49.05,20.45 48.41,21.08 38.1,21.08 X7.13
SPI2_MISO  (via drill 0.35)
  Top 0.254: R209.1 48.34,23.62 v49.3,22.66
  Bottom 0.254: JP8.5 292.35,23.11 291.08,24.38 288.8,24.38 282.96,18.54 218.44,18.54 213.61,23.37 JP7.5 210.57,22.1 203.2,22.1 199.14,18.03 136.4,18.03 131.32,23.11 JP6.5 130.3,23.11 129.03,21.84 110.24,21.84 105.16,16.76 49.78,16.76 49.53,17.02 49.53,22.43 v49.3,22.66
SPI2_MOSI
  Top 0.254: X7.16 35.56,24.13 36.83,22.86 38.61,22.86 39.62,21.84 48.54,21.84 49.15,21.23 125.63,21.23 127,22.61 127.76,22.61 JP6.6 129.54,24.38 132.59,24.38 133.86,23.11 133.86,20.57 134.37,20.07 204.22,20.07 207.26,23.11 209.04,23.11 JP7.6 210.57,24.64 212.34,24.64 218.69,18.29 283.97,18.29 288.8,23.11 JP8.6
SPI2_SCK
  Top 0.254: X7.14 35.31,21.59 36.58,20.32 48.26,20.32 48.77,19.81 127.51,19.81 JP6.4 | 128.02,20.32 JP6.4 | JP6.4 129.54,19.3 132.33,19.3 133.35,18.29 205.23,18.29 207.77,20.83 JP7.4 210.31,19.81 210.31,19.56 212.6,19.56 215.65,16.51 285.24,16.51 289.31,20.57 JP8.4
SPI5_CS
  Top 0.254: JP11.9 259.51,5.51 257.05,3.05 233.43,3.05 227.58,8.89 211.58,8.89 205.74,3.05 182.55,3.05 JP10.9
  Top 0.305: X7.5 40.39,8.64 40.39,3.81 41.66,2.54 95.5,2.54 98.04,5.08 98.04,6.27 JP9.9
  Bottom 0.254: JP10.9 178.77,5.28 176.28,2.79 100.33,2.79 97.76,5.36 JP9.9
SPI5_MISO
  Top 0.254: R112.1 47.5,16 93.43,16 98.27,11.16 98.27,10.95 99.06,10.16 99.06,8.38 98.55,7.87 96.01,7.87 95.22,7.09 JP9.7
  Bottom 0.254: JP9.7 95.22,4.09 97.14,2.17 177.29,2.17 | 177.29,2.17 181.5,2.17 182.88,3.56 204.98,3.56 210.82,9.4 227.84,9.4 233.68,3.56 254.51,3.56 256.97,6.02 JP11.7 | JP10.7 176.22,7.57 176.78,8.13 179.58,8.13 180.09,7.62 180.09,5.08 177.67,2.67 177.67,2.55 177.29,2.17
SPI5_MOSI
  Top 0.254: JP11.8 256.97,10.14 253.38,13.73 194.82,13.46 193.04,15.24 179.07,15.24 176.22,12.4 JP10.8
  Bottom 0.254: JP10.8 170.87,14.73 100.33,14.73 98.81,13.21 98.81,10.41 99.06,10.16 99.06,8.38 98.55,7.87 96.5,7.87 95.25,9.12
  Bottom 0.305: X7.8 36.46,12.57 44.57,12.57 46.99,14.99 90.42,14.99 95.25,10.16 95.25,9.12 JP9.8
SPI5_SCK
  Top 0.305: X7.6 35.99,11.43 37.12,12.57 45.08,12.57 47.75,15.24 93.47,15.24 97.76,10.95 JP9.10
  Bottom 0.254: JP9.10 97.76,13.18 100.08,15.49 172.64,15.49 JP10.10 178.77,12.4 182.12,15.75 254.25,15.75 259.51,10.49 JP11.10
TOUCH1  (via drill 3.17 pad 7.11)
  Top 0.203: -40.13,84.33 -39.37,83.57 -39.37,78.23 -38.61,77.47 X6.1
  Top 0.254: -40.13,84.33 -41.4,85.6 -57.91,85.6 -64.63,92.31
  Top 0.508: -64.63,92.31 v-64.63,92.36
TOUCH2  (via drill 3.17 pad 7.11)
  Top 0.203: -37.34,84.2 -37.08,83.95 X6.2
  Top 0.254: -37.34,84.2 -40,86.87 -51.08,86.87 v-56.57,92.36
TOUCH3  (via drill 3.17 pad 7.11)
  Top 0.203: -36.14,84.91 -35.81,84.58 -35.81,78.23 -35.05,77.47 X6.3
  Top 0.254: -36.14,84.91 -39.17,87.94 -44.59,87.94 -45,88.84 v-48.51,92.36
TOUCH4  (via drill 3.17 pad 7.11)
  Top 0.203: -35.05,82.8 -35.05,80.52 X6.4
  Top 0.254: v-40.46,92.36 -40.55,92.36 -35.05,86.87 -35.05,82.8
TOUCH5  (via drill 3.17 pad 7.11)
  Top 0.203: -33.45,81.2 -33.45,80.95 -33.27,80.77 -33.27,78.49 -32.26,77.47 X6.5
  Top 0.254: v-32.4,92.36 -33.45,92.35 -33.45,81.2
TOUCH6  (via drill 3.17 pad 7.11)
  Top 0.203: -32.26,82.55 -32.26,80.26 X6.6
  Top 0.254: -32.26,82.55 -32.26,86.23 -26.13,92.36 v-24.35,92.36
TOUCH7  (via drill 3.17 pad 7.11)
  Top 0.203: -30.99,84.33 -30.99,81.53 -30.73,81.28 -30.73,78.74 X6.7
  Top 0.254: -30.99,84.33 -27.36,87.96 -20.4,87.96 v-16.29,92.36
TOUCH8  (via drill 3.17 pad 7.11)
  Top 0.203: -29.72,84.25 -29.72,80.26 X6.8
  Top 0.254: -29.72,84.25 -26.85,87.12 -19.7,87.12 -19.19,87.63 -12.95,87.63 v-8.23,92.35 v-8.24,92.36
TOUCH9  (via drill 3.17 pad 7.11)
  Top 0.203: -28.45,84.12 -28.45,81.28 -28.19,81.03 -28.19,78.74 X6.9
  Top 0.254: -28.45,84.12 -26.19,86.38 -5.05,86.38 0.92,92.36 v-0.18,92.36
TOUCH10  (via drill 3.17 pad 7.11)
  Top 0.203: -27.18,83.87 -27.18,80.26 X6.10
  Top 0.254: -27.18,83.87 -25.55,85.5 3.33,85.5 v7.87,92.36
TOUCH11  (via drill 3.17 pad 7.11)
  Route15 0.203: -25.93,85.12 -25.93,81.56 -25.65,81.28 -25.65,78.74 X6.11
  Route15 0.254: -25.93,85.12 -23.7,87.35 13.91,87.35 v15.93,92.36
TOUCH12  (via drill 3.17 pad 7.11)
  Route15 0.203: -24.64,83.57 -24.64,80.26 X6.12
  Route15 0.254: -24.64,83.57 -22.4,85.8 23.09,85.82 24.37,86.85 24.37,91.97 v23.99,92.36

### Text on the board
tPlace: + | - | + | I | - | G | H
Patch_BOT: Lout | Rout | Lout | Rout | Lout | Rout | DGND | 5Vin | DGND | 5Vin | DGND | 5Vin | I2C4 | I2C4 | PD13 | SDA | PD13 | PD13 | SDA | PC6 | PC6 | PC6 | SCL | SCL | PD12 | D11 | PD12 | D11 | SCL | PD12 | D11 | Lin | Lin | Rin | MISO | Rin | MOSI | PB15 | PB14 | Lin | Rin | MISO | MOSI | PB15 | PB14 | MOSI | PB15 | PB14 | SCLK | PB13 | PB12 | CS | SCLK | PB13 | PB12 | SCLK | PB13 | PB12 | CS | 3v3a | 3v3a | 3v3D | 3v3a | PG10 | 3v3D | DGND | PG10 | DGND | PG10 | 3v3D | DGND | PA3 | PA5 | PC5 | PA1 | PA3 | PA5 | PA7 | PC5 | PB1 | PD7 | SCL | PA1 | PA7 | PB1 | PD7 | SCL | PA1 | PA3 | PA5 | PA7 | PC5 | PB1 | PD7 | SCL | AGND | PA4 | PA6 | PC4 | PB0 | SDA | AGND | PA0 | PA2 | PA4 | PA6 | PC4 | PB0 | PG9 | PG12 | SDA | AGND | PA4 | PA6 | PC4 | PB0 | SDA | PA0 | PA2 | PG9 | PG12 | PA0 | PA2 | PG9 | PG12